# EAGLE board ENERGIS_Main-Board-1.1.0 (EAGLE 9.2.1), part 1 of 3
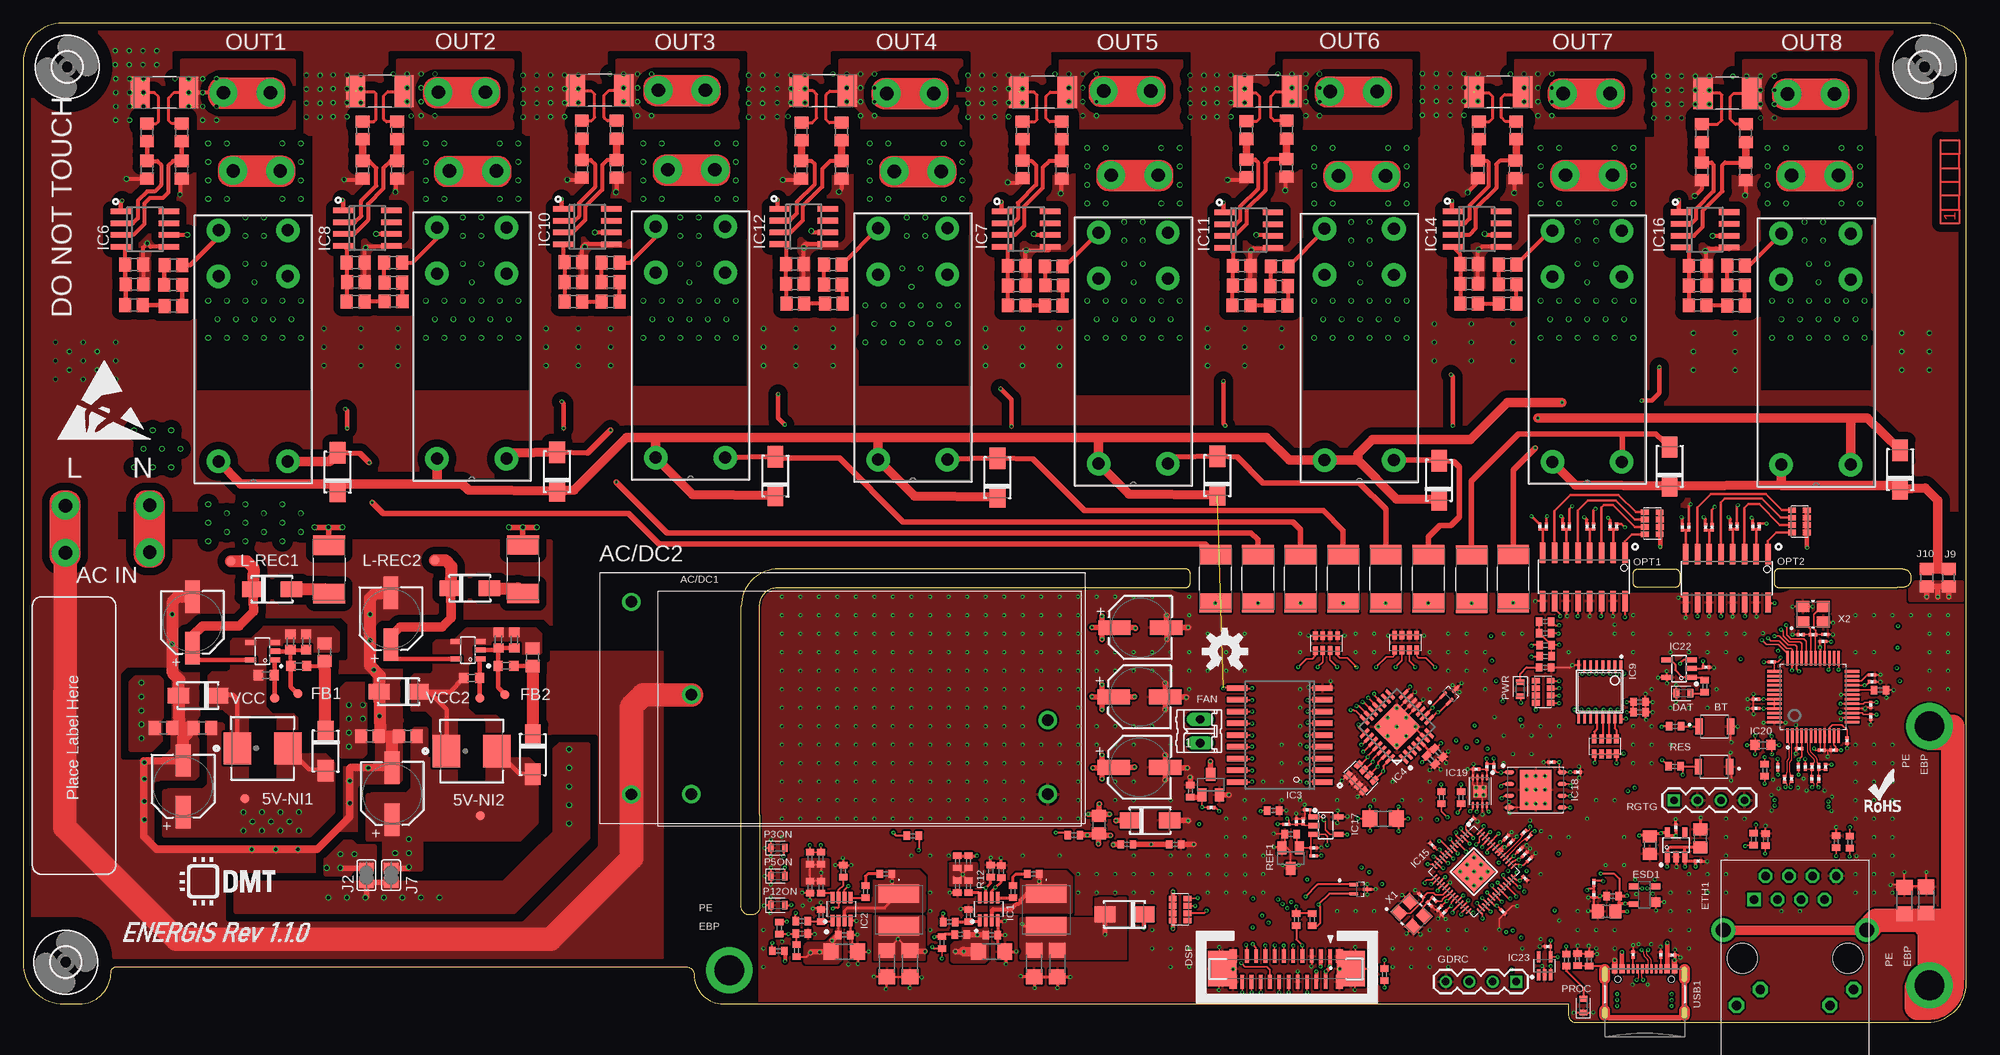
[diagram p10: board, top side]
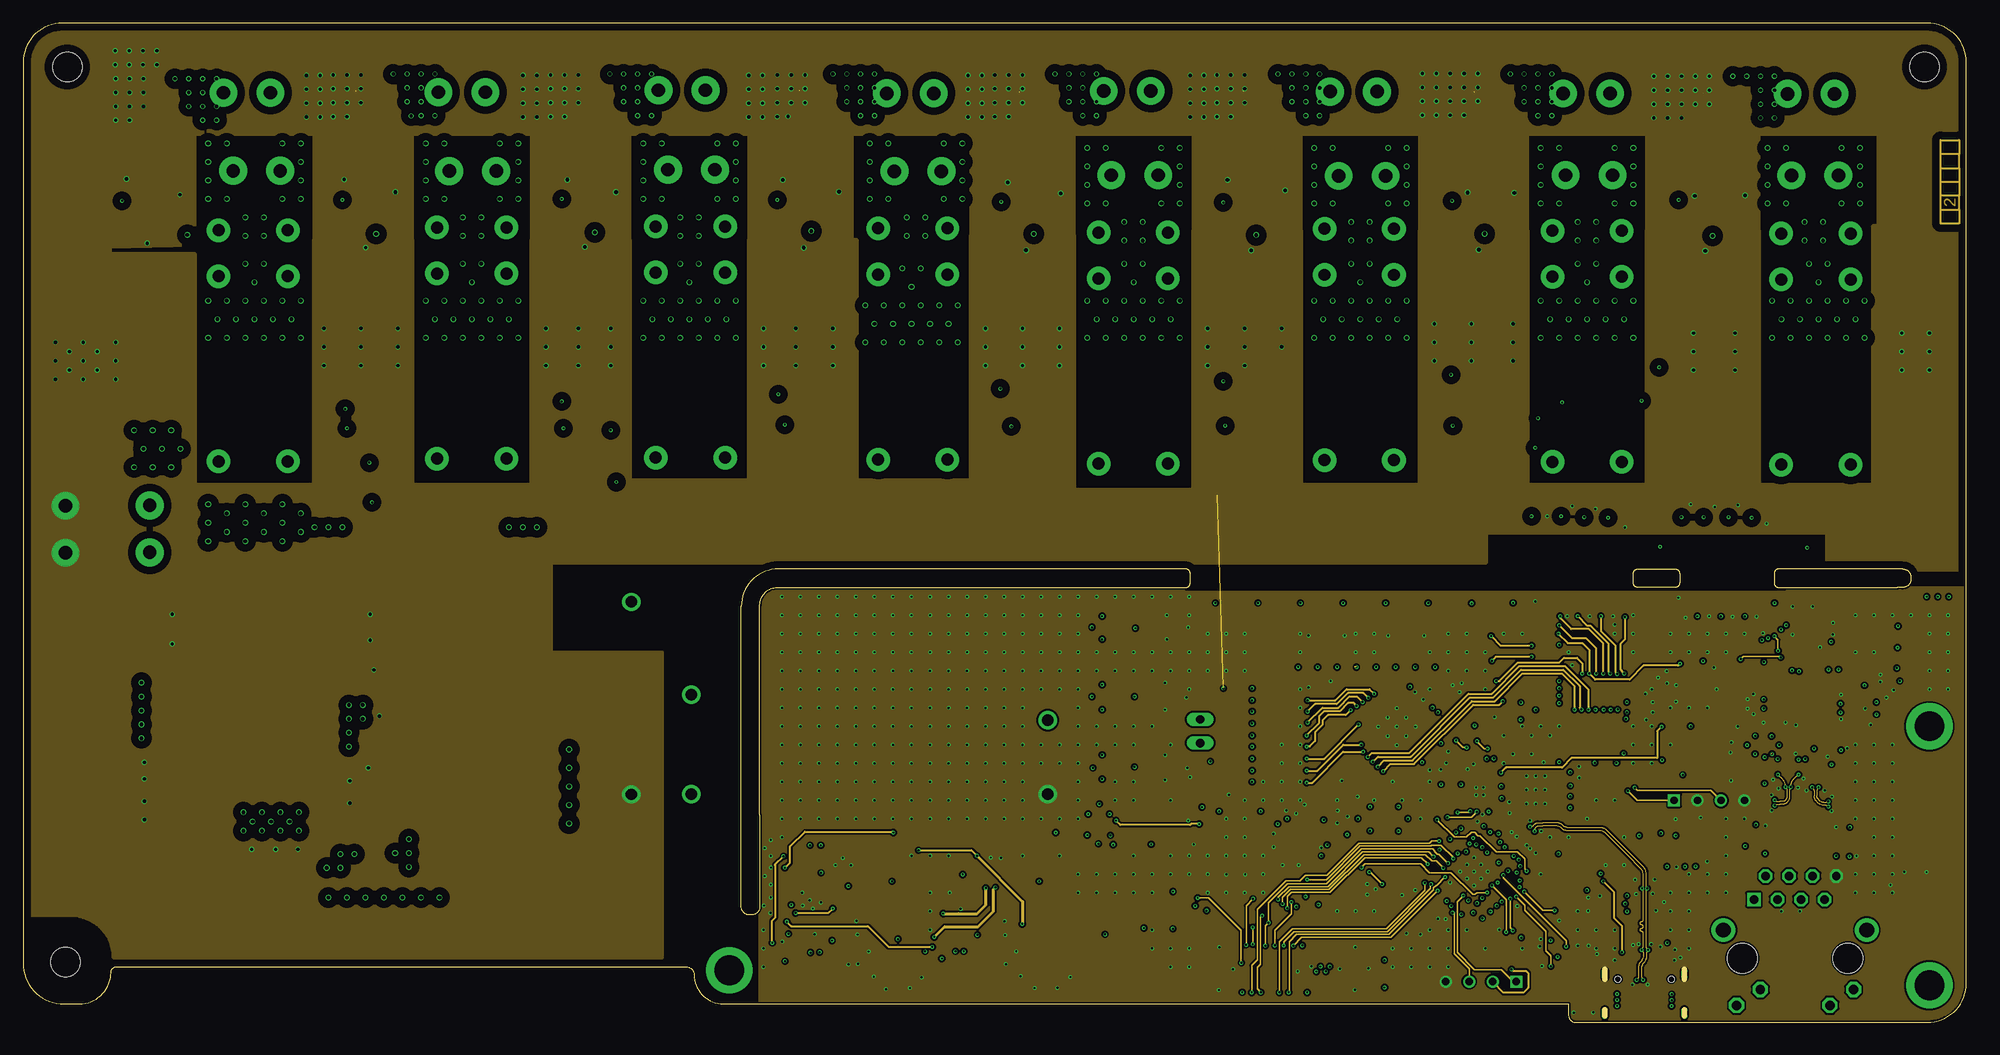
[diagram p11: board, inner layer L2-SIG-HS/AGND]
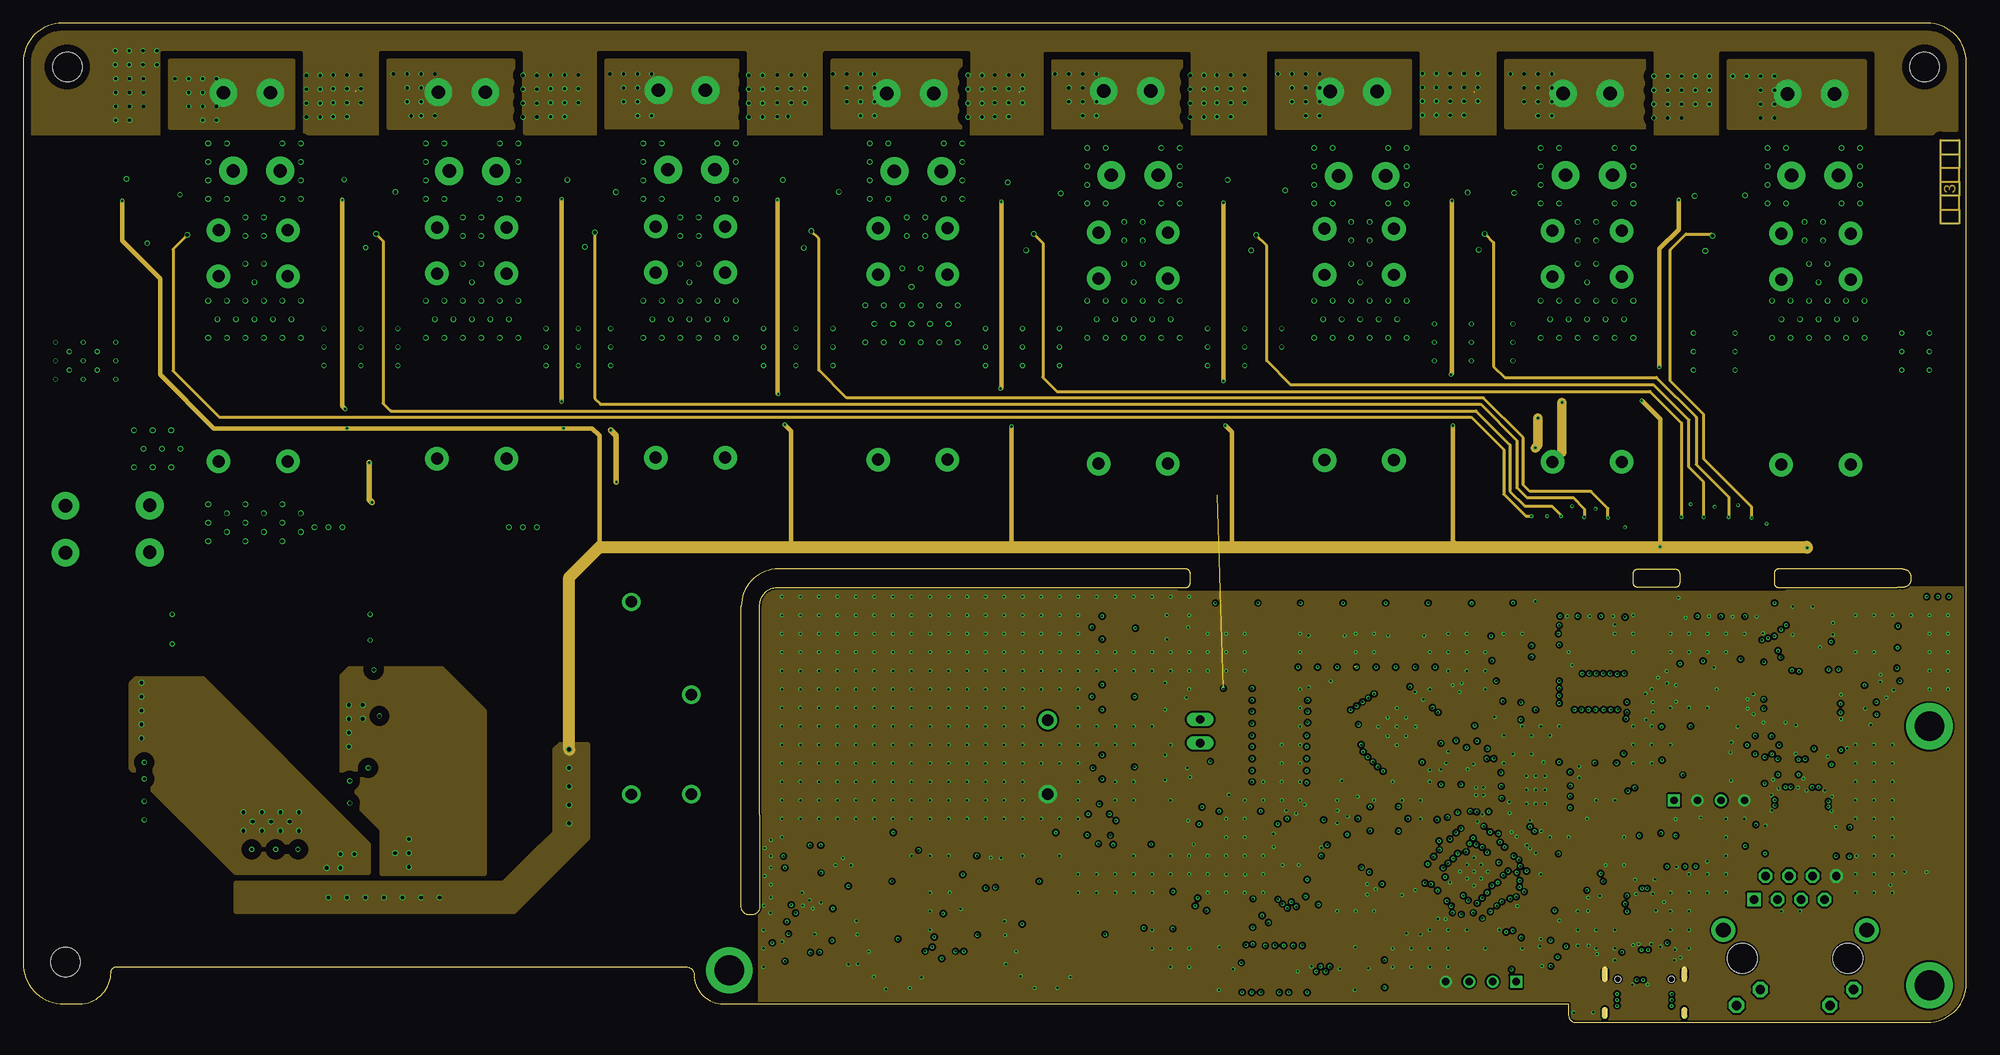
[diagram p12: board, inner layer L3-GND/SIG]
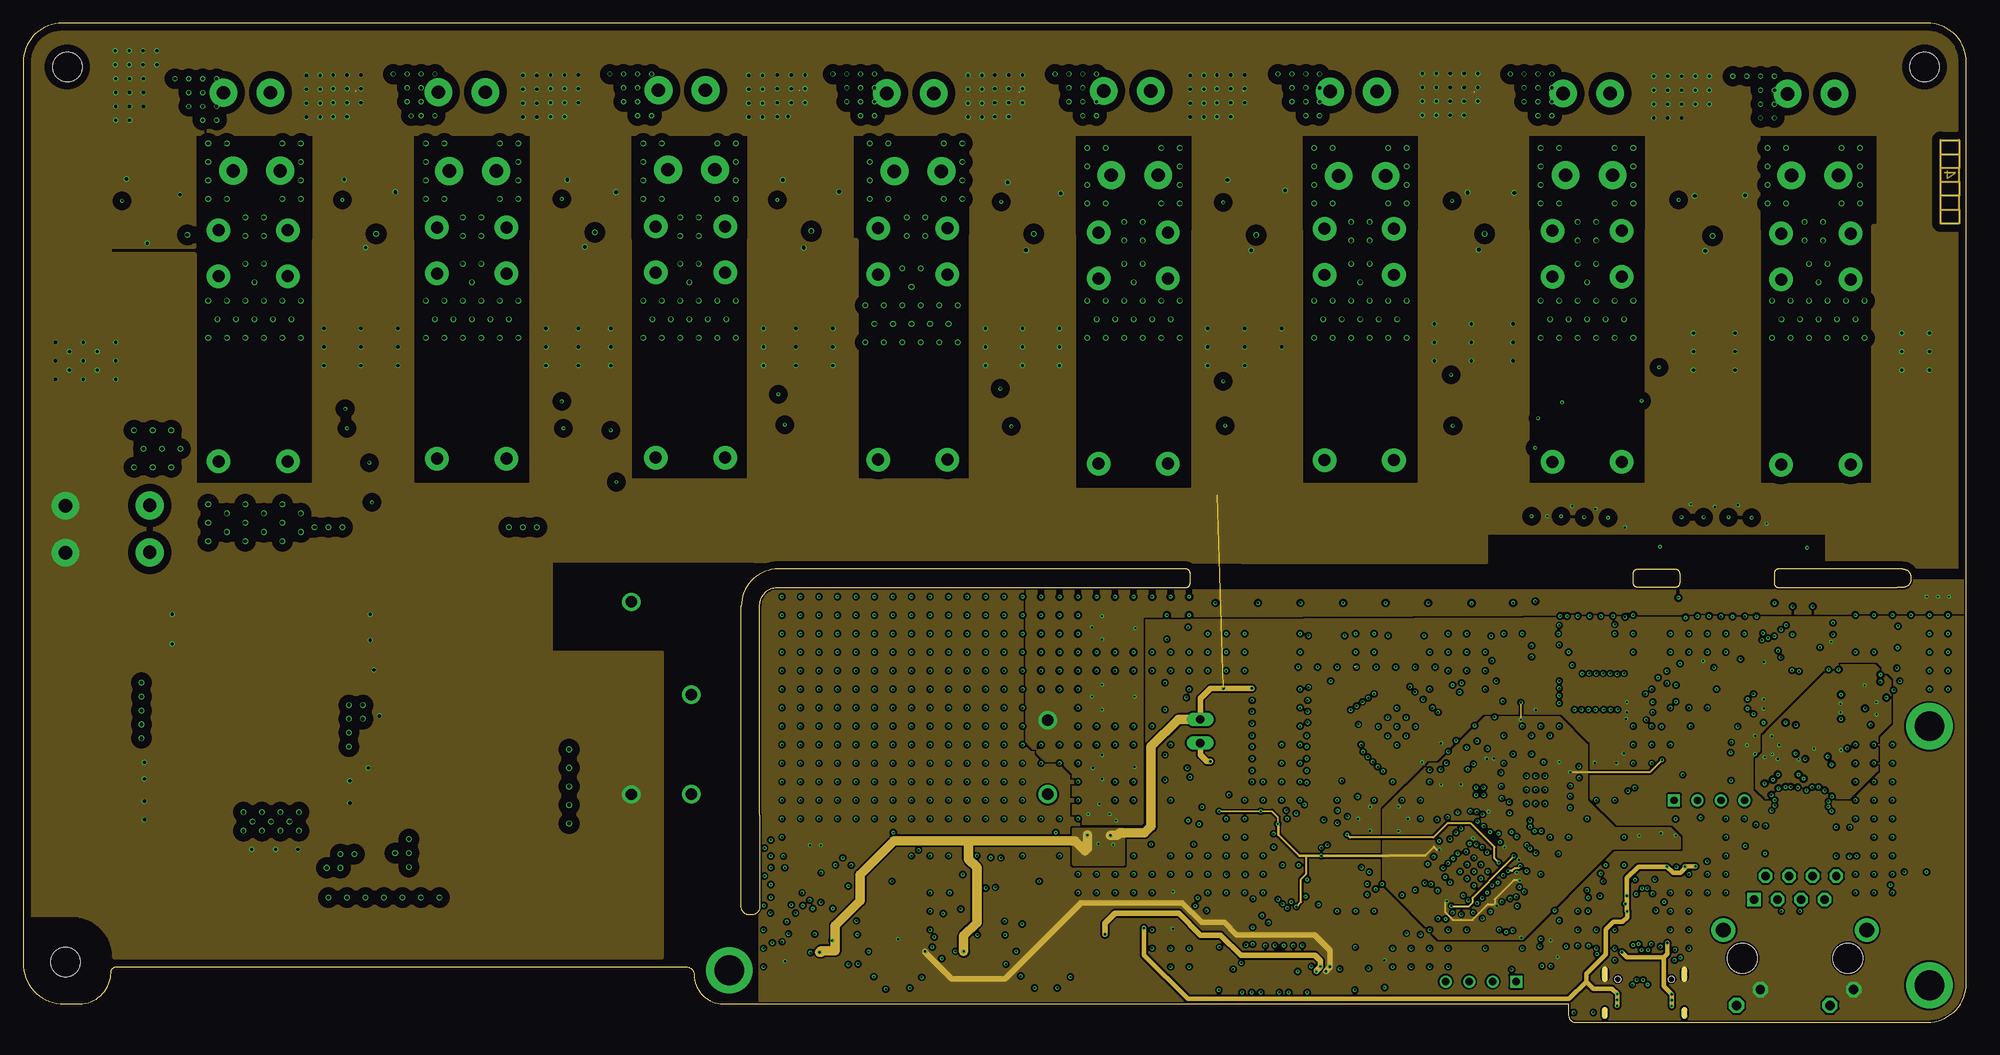
[diagram p13: board, inner layer L4-PWR/AGND]
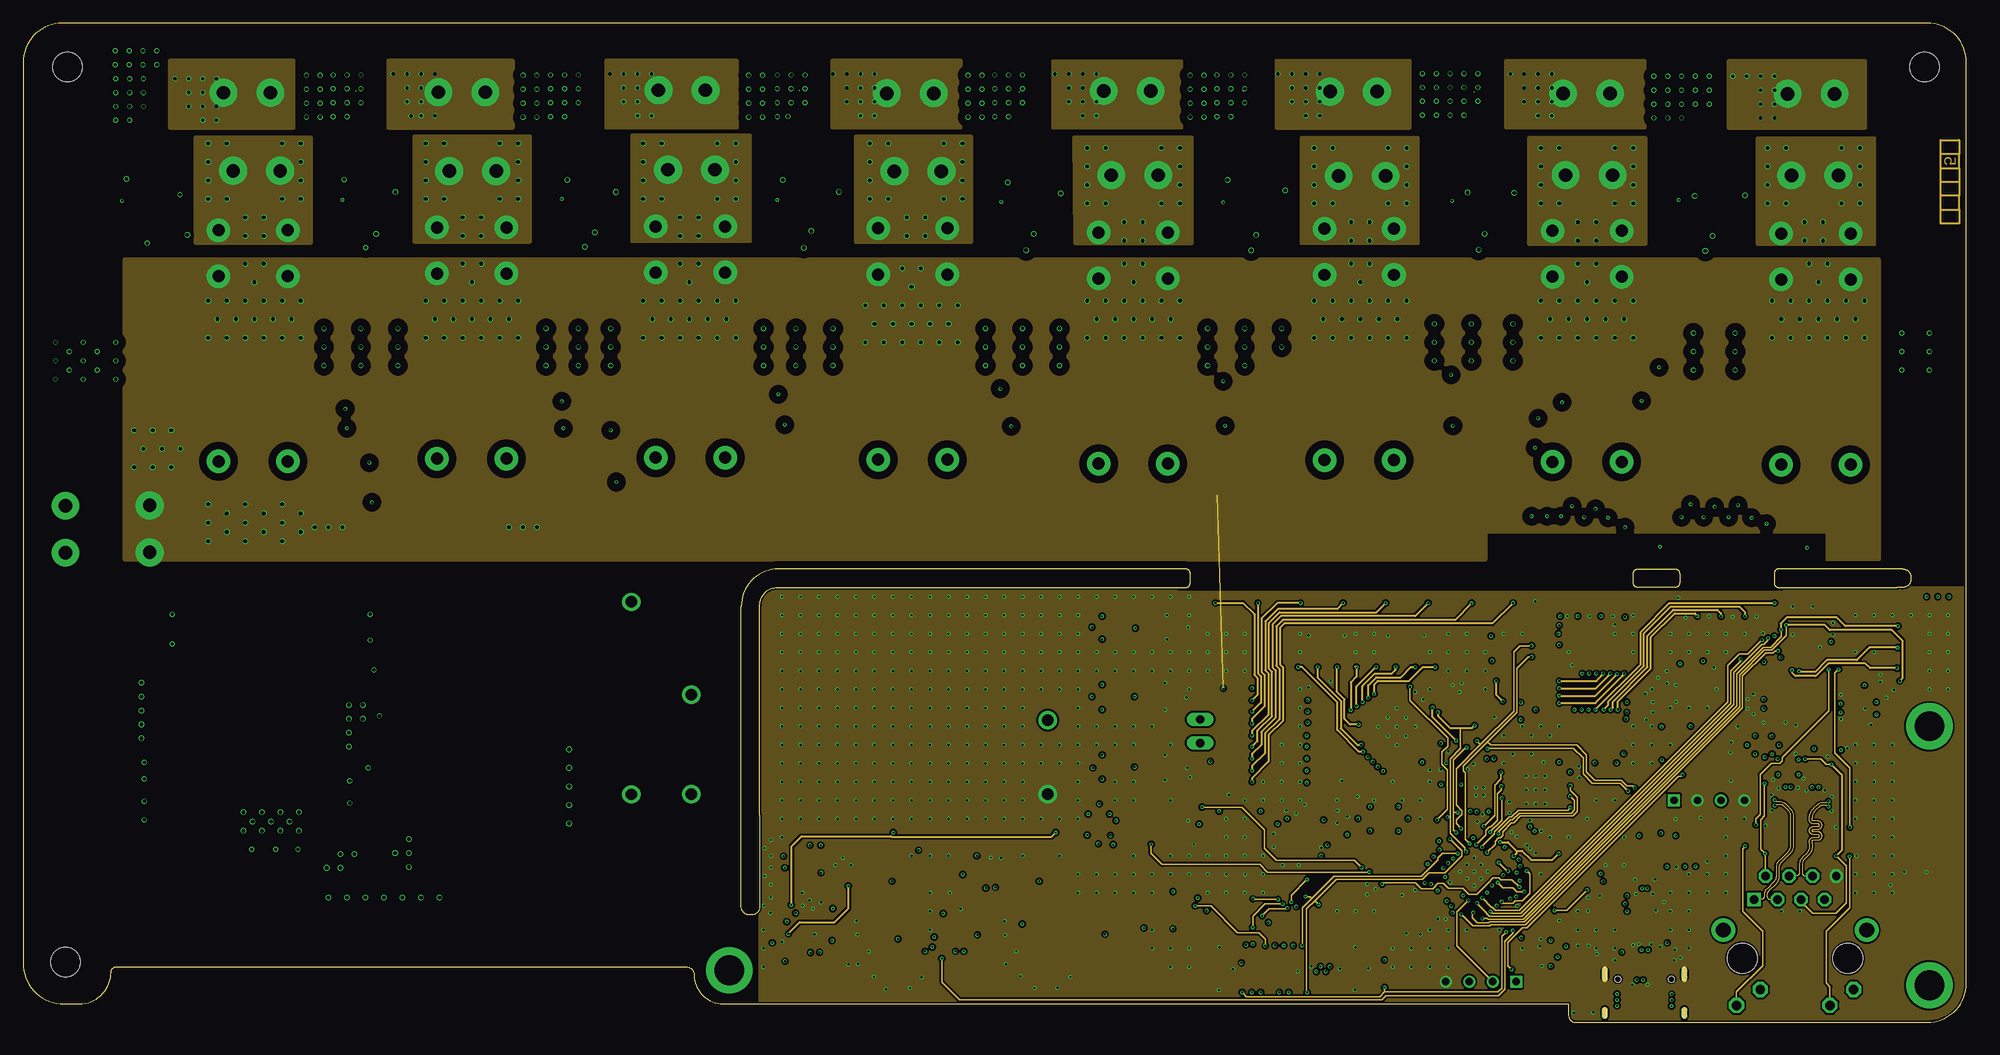
[diagram p14: board, inner layer L5-SIG_LS/AC_L]
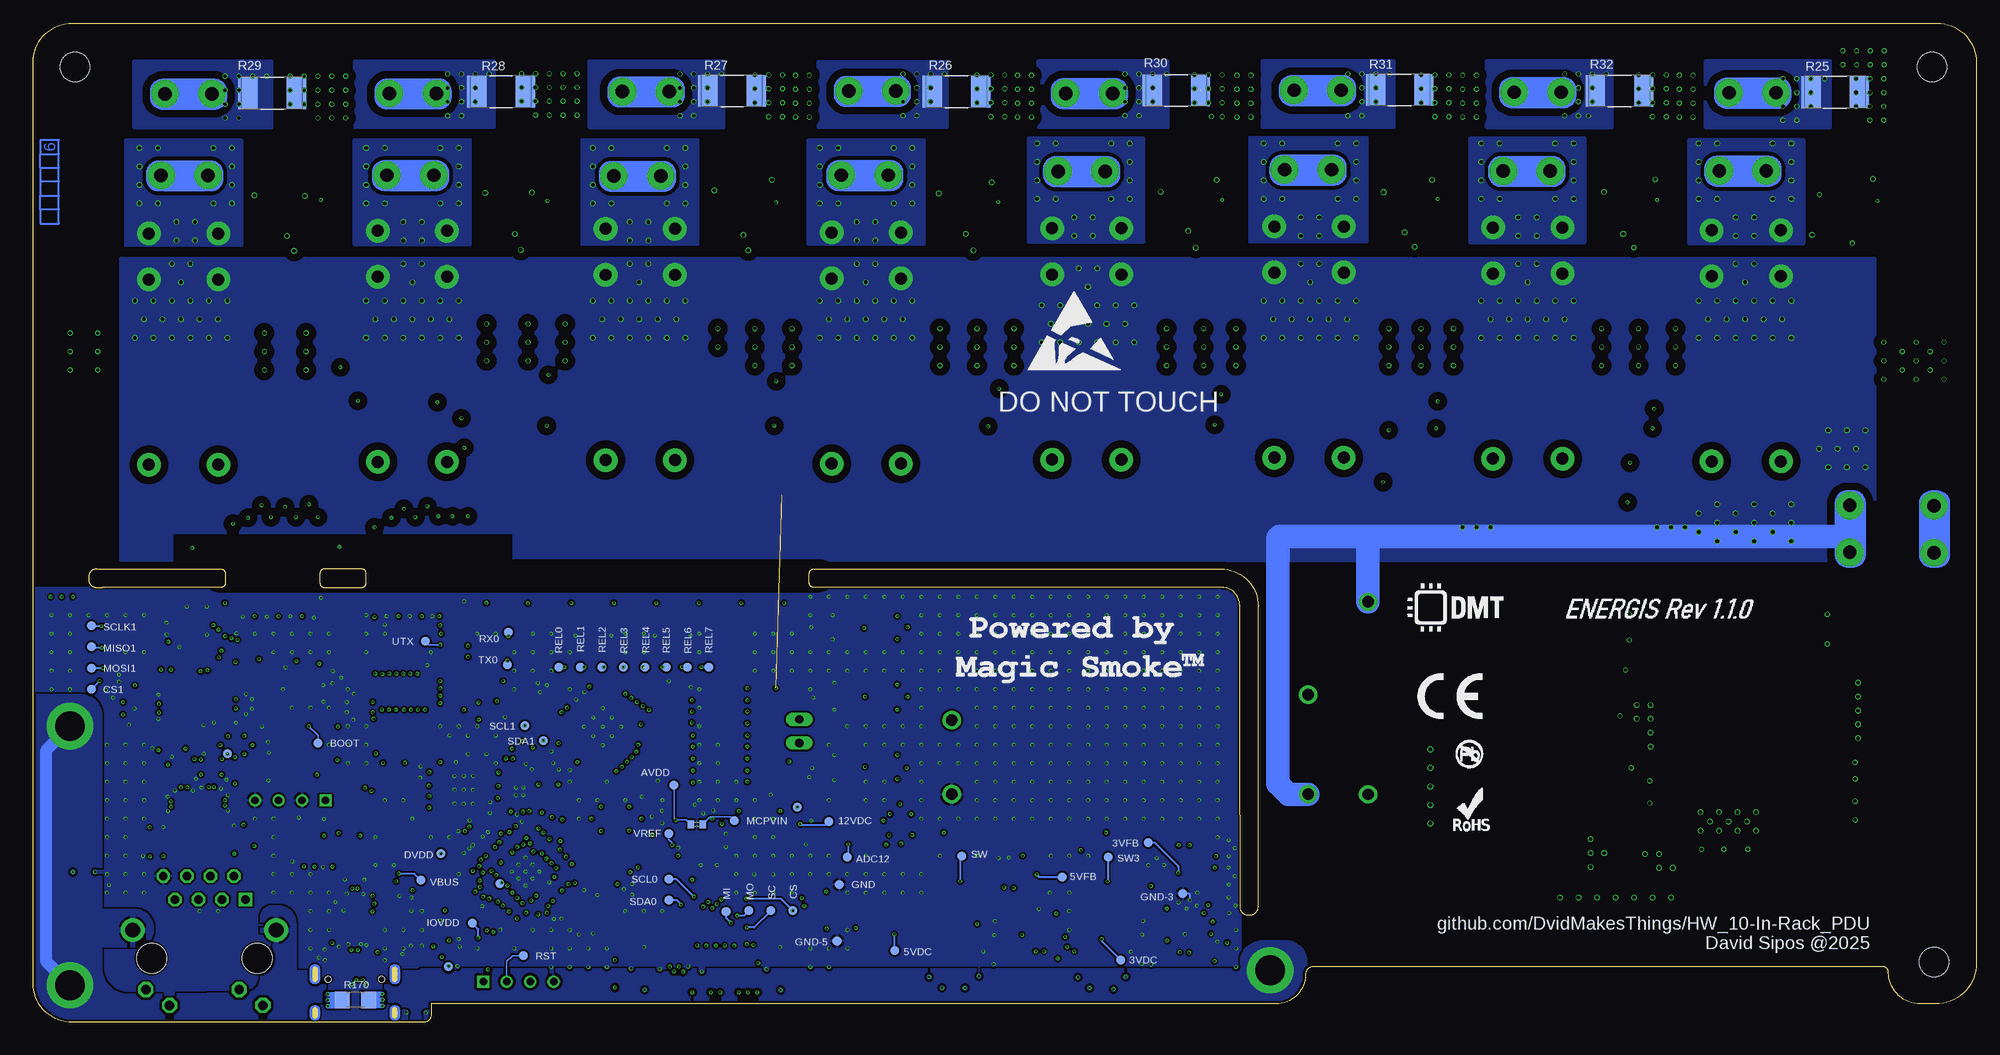
[diagram p15: board, bottom side, seen from below]

Size 210 x 108 mm. Coordinates in mm from the lower left corner, seen from the top.
Outline: 77.6,12.48 77.6,44.97
Outline: 77.6,44.97 arc-90 81.63,49 125.62,49 arc-90 126.12,48.5 126.12,47.5 arc-90 125.62,47 81.51,47 arc90 79.6,45.09 79.6,22.44 79.6,12.5 arc-90 78.7,11.6 78.5,11.6 arc-90 77.6,12.5 77.6,44.97
Outline: 210,4.23 210,103.77 arc90 205.77,108 4.23,108 arc90 0,103.77 0,6.39 arc90 4.39,2 6.08,2 arc90 9.5,5.42 arc-90 10.08,6 71.65,6 arc-90 72.5,5.15 arc90 75.65,2 167,2 167,0.77 arc90 167.77,0 205.77,0 arc90 210,4.23
Outline: 203.11,49 arc-90 204,48.11 204,47.9 arc-90 203.1,47 202.53,47 189.72,47 arc-90 189.22,47.5 189.22,48.5 arc-90 189.72,49 203.11,49
Outline: 174.5,49 178.5,49 arc-90 179,48.5 179,47.5 arc-90 178.5,47 174.5,47 arc-90 174,47.5 174,48.5 arc-90 174.5,49
Copper layers (1+2*3+14*15+16): L1-GND/SIG 0.035mm / dielectric 0.0994mm / L2-SIG-HS/AGND 0.0152mm / dielectric 0.55mm / L3-GND/SIG 0.0152mm / dielectric 0.1088mm / L4-PWR/AGND 0.0152mm / dielectric 0.55mm / L5-SIG_LS/AC_L 0.0152mm / dielectric 0.0994mm / L3-GND/AC_L 0.035mm
Design rules "JLC06161H-3313_6-layer_50RSE-85RD-90RD-100RD": minimum track width 3.5mil, minimum drill 0.15mm, track to track 3.5mil, track to pad 3.5mil, pad to pad 3.5mil, via to via 3.5mil, smd to smd 3.5mil, copper to edge 0.2mm, drill to drill 6mil, minimum pad ring 3.5mil, minimum via ring 3.5mil, stop-mask expansion 0.05mm, vias tented up to drill 16mil, thermal gap 10mil
Net classes: 0 50R_SE: width 0.148 mm, drill 0.2 mm, clearance 0.163 mm; 1 100R_DIFFPAIR: width 0.102 mm, drill 0.2 mm, clearance 0.191 mm; 2 90R_DIFFPAIR: width 0.131 mm, drill 0.2 mm, clearance 0.191 mm; 3 AC_MEA: width 0.406 mm, drill 0.35 mm, clearance 0.203 mm; 4 AC_SIG: width 0.305 mm, drill 0.2 mm, clearance 0.35 mm
tKeepout: 1 lines
bKeepout: 1 lines
tRestrict: 163 lines
bRestrict: 1 lines
vRestrict: 1 lines

## Footprints (pad centres in the part's own frame; a part is rotated, then mirrored left to right if it is on the bottom)
TP-ROUND = smd 1 x 1: TP 0,0
IRM_10_12 = drill 1.24: +V 19.25,0.02; -V 19.25,-7.98; AC_L -19.25,-7.98; AC_N -19.25,2.77
IRM_15_12 = drill 1.24: +V 23.47,-2.4; -V 23.47,-10.4; AC/L -21.53,10.4; AC/N -21.53,-10.4
1217861-1 = drill 1.45 pad 3: 1 0,0; 2 5.08,0
B3U-1000P = smd 0.8 x 1.7: 1 -1.7,0; 2 1.7,0
1206 = smd 1.6 x 1.803: 1 -1.422,0; 2 1.422,0
0402 = smd 0.7 x 0.9: 1 -0.65,0; 2 0.65,0
0603 = smd 1 x 1.1: 1 -0.85,0; 2 0.85,0
6.3X7.7(DXL) = smd 3.5 x 1.6: 1 2.8,0; 2 -2.8,0
0805 = smd 1.3 x 1.5: 1 -0.95,0; 2 0.95,0
0201 = smd 0.34 x 0.35: 1 -0.275,0; 2 0.275,0
SMA/DO-214AC = smd 2.3 x 1.7: A 2.1,0; C -2.1,0
SC75 = smd 0.99 x 0.3: 1 -0.72,0.5; 2 -0.72,-0.5; 3 0.72,0
LED-0603 = smd 0.612 x 0.912: A 0.75,0; C -0.75,0
FPC20 = smd 0.4 x 1.5: 1 -4.552,-1.362; 2 -4.052,1.438; 3 -3.552,-1.362; 4 -3.052,1.438; 5 -2.552,-1.362; 6 -2.052,1.438; 7 -1.552,-1.362; 8 -1.052,1.438; 9 -0.552,-1.362; 10 -0.052,1.438; 11 0.448,-1.362; 12 0.948,1.438; 13 1.448,-1.362; 14 1.948,1.438; 15 2.448,-1.362; 16 2.948,1.438; 17 3.448,-1.362; 18 3.948,1.438; 19 4.448,-1.362; 20 4.948,1.438 | smd 3.048 x 3.81: Z0 -6.795,0; Z5 7.112,0 | smd 0.8 x 1.5: Z1 -5.552,-1.362; Z2 -5.552,1.438; Z3 5.948,-1.362; Z4 5.948,1.438
SOT143 = smd 1 x 1: 1 -0.75,-1.2 | smd 0.6 x 1: 2 0.95,-1.2; 3 0.95,1.2; 4 -0.95,1.2
J1B1211CCD = drill 0.9 square: 1 -4.445,6.35 | drill 0.9 octagon: 2 -3.175,8.89; 3 -1.905,6.35; 4 -0.635,8.89; 5 0.635,6.35; 6 1.905,8.89; 7 3.175,6.35; 8 4.445,8.89 | drill 1.02 octagon: 9 -6.325,-5.08; 10 -3.758,-3.38; 11 3.758,-5.08; 12 6.325,-3.38 | drill 1.6: 13 -7.75,3.05; 14 7.75,3.05 | hole 3.25: -5.715,0; 5.715,0
02P = drill 0.914 long: 1 -1.27,0; 2 1.27,0
1X4 = drill 0.8 square: 1 0,3.81 | drill 0.8: 2 0,1.27; 3 0,-1.27; 4 0,-3.81
SOT65P280X110-8N = smd 1.259 x 0.4: 1 -1.228,0.975; 2 -1.228,0.325; 3 -1.228,-0.325; 4 -1.228,-0.975; 5 1.228,-0.975; 6 1.228,-0.325; 7 1.228,0.325; 8 1.228,0.975
SO18 = smd 0.6 x 2.2: 1 -5.08,-4.6; 2 -3.81,-4.6; 3 -2.54,-4.6; 4 -1.27,-4.6; 5 0,-4.6; 6 1.27,-4.6; 7 2.54,-4.6; 8 3.81,-4.6; 9 5.08,-4.6; 10 5.08,4.6; 11 3.81,4.6; 12 2.54,4.6; 13 1.27,4.6; 14 0,4.6; 15 -1.27,4.6; 16 -2.54,4.6; 17 -3.81,4.6; 18 -5.08,4.6
QFN28[6X6]ML = smd 1.27 x 0.35: 1 -2.985,1.95; 2 -2.985,1.3; 3 -2.985,0.65; 4 -2.985,0; 5 -2.985,-0.65; 6 -2.985,-1.3; 7 -2.985,-1.95; 15 2.985,-1.95; 16 2.985,-1.3; 17 2.985,-0.65; 18 2.985,0; 19 2.985,0.65; 20 2.985,1.3; 21 2.985,1.95 | smd 0.35 x 1.27: 8 -1.95,-2.985; 9 -1.3,-2.985; 10 -0.65,-2.985; 11 0,-2.985; 12 0.65,-2.985; 13 1.3,-2.985; 14 1.95,-2.985; 22 1.95,2.985; 23 1.3,2.985; 24 0.65,2.985; 25 0,2.985; 26 -0.65,2.985; 27 -1.3,2.985; 28 -1.95,2.985 | smd 3.7 x 3.7: PAD 0,0
SOT23-5 = smd 0.55 x 1.2: 1 -0.95,-1.3; 2 0,-1.3; 3 0.95,-1.3; 4 0.95,1.3; 5 -0.95,1.3
SO8 = smd 0.6 x 2.2: 1 -1.905,-2.6; 2 -0.635,-2.6; 3 0.635,-2.6; 4 1.905,-2.6; 5 1.905,2.6; 6 0.635,2.6; 7 -0.635,2.6; 8 -1.905,2.6
TSSOP16 = smd 0.305 x 0.991: 1 -2.275,-2.918; 2 -1.625,-2.918; 3 -0.975,-2.918; 4 -0.325,-2.918; 5 0.325,-2.918; 6 0.975,-2.918; 7 1.625,-2.918; 8 2.275,-2.918; 9 2.275,2.918; 10 1.625,2.918; 11 0.975,2.918; 12 0.325,2.918; 13 -0.325,2.918; 14 -0.975,2.918; 15 -1.625,2.918; 16 -2.275,2.918
QFN56 = smd 0.837 x 0.22: 1 -3.437,2.6; 2 -3.437,2.2; 3 -3.437,1.8; 4 -3.437,1.4; 5 -3.437,1; 6 -3.437,0.6; 7 -3.437,0.2; 8 -3.437,-0.2; 9 -3.437,-0.6; 10 -3.437,-1; 11 -3.437,-1.4; 12 -3.437,-1.8; 13 -3.437,-2.2; 14 -3.437,-2.6; 29 3.437,-2.6; 30 3.437,-2.2; 31 3.437,-1.8; 32 3.437,-1.4; 33 3.437,-1; 34 3.437,-0.6; 35 3.437,-0.2; 36 3.437,0.2; 37 3.437,0.6; 38 3.437,1; 39 3.437,1.4; 40 3.437,1.8; 41 3.437,2.2; 42 3.437,2.6 | smd 0.22 x 0.837: 15 -2.6,-3.437; 16 -2.2,-3.437; 17 -1.8,-3.437; 18 -1.4,-3.437; 19 -1,-3.437; 20 -0.6,-3.437; 21 -0.2,-3.437; 22 0.2,-3.437; 23 0.6,-3.437; 24 1,-3.437; 25 1.4,-3.437; 26 1.8,-3.437; 27 2.2,-3.437; 28 2.6,-3.437; 43 2.6,3.437; 44 2.2,3.437; 45 1.8,3.437; 46 1.4,3.437; 47 1,3.437; 48 0.6,3.437; 49 0.2,3.437; 50 -0.2,3.437; 51 -0.6,3.437; 52 -1,3.437; 53 -1.4,3.437; 54 -1.8,3.437; 55 -2.2,3.437; 56 -2.6,3.437 | smd 3.2 x 3.2: PAD 0,0
SON127P600X500X75-8N = smd 1.012 x 0.432: 1 -2.85,1.905; 2 -2.85,0.635; 3 -2.85,-0.635; 4 -2.85,-1.905; 5 2.85,-1.905; 6 2.85,-0.635; 7 2.85,0.635; 8 2.85,1.905 | smd 3.4 x 4.3: PAD 0,0
SON50P300X200X50-9T130X140N = smd 0.711 x 0.27: 1 -1.501,0.75; 2 -1.501,0.25; 3 -1.501,-0.25; 4 -1.501,-0.75; 5 1.501,-0.75; 6 1.501,-0.25; 7 1.501,0.25; 8 1.501,0.75 | smd 1.3 x 1.4: 9 0,0
LQFP48 = smd 1.56 x 0.28: 1 -4.18,2.75; 2 -4.18,2.25; 3 -4.18,1.75; 4 -4.18,1.25; 5 -4.18,0.75; 6 -4.18,0.25; 7 -4.18,-0.25; 8 -4.18,-0.75; 9 -4.18,-1.25; 10 -4.18,-1.75; 11 -4.18,-2.25; 12 -4.18,-2.75; 25 4.18,-2.75; 26 4.18,-2.25; 27 4.18,-1.75; 28 4.18,-1.25; 29 4.18,-0.75; 30 4.18,-0.25; 31 4.18,0.25; 32 4.18,0.75; 33 4.18,1.25; 34 4.18,1.75; 35 4.18,2.25; 36 4.18,2.75 | smd 0.28 x 1.56: 13 -2.75,-4.18; 14 -2.25,-4.18; 15 -1.75,-4.18; 16 -1.25,-4.18; 17 -0.75,-4.18; 18 -0.25,-4.18; 19 0.25,-4.18; 20 0.75,-4.18; 21 1.25,-4.18; 22 1.75,-4.18; 23 2.25,-4.18; 24 2.75,-4.18; 37 2.75,4.18; 38 2.25,4.18; 39 1.75,4.18; 40 1.25,4.18; 41 0.75,4.18; 42 0.25,4.18; 43 -0.25,4.18; 44 -0.75,4.18; 45 -1.25,4.18; 46 -1.75,4.18; 47 -2.25,4.18; 48 -2.75,4.18
SC70-5 = smd 1.186 x 0.397: 1 -0.962,0.65; 2 -0.962,0; 3 -0.962,-0.65; 4 0.962,-0.65; 5 0.962,0.65
SJ = smd 1.168 x 1.6: 1 -0.762,0; 2 0.762,0
RELAY_G2RL-1A-E_DC5_OMR = drill 1.295 pad 2.54: 1 -3.683,12.776; 3 -3.683,-7.239; 4 -3.683,-12.217; 5 3.81,-12.217; 6 3.81,-7.239; 8 3.81,12.776
SRR5228A = smd 4.4 x 2: 1 0,1.75; 2 0,-1.75
L-6.6X6.6 = smd 2.95 x 3.5: 1 -2.725,0; 2 2.725,0
SO16 = smd 0.61 x 2.21: 1 -4.445,-2.616; 2 -3.175,-2.616; 3 -1.905,-2.616; 4 -0.635,-2.616; 5 0.635,-2.616; 6 1.905,-2.616; 7 3.175,-2.616; 8 4.445,-2.616; 9 4.445,2.616; 10 3.175,2.616; 11 1.905,2.616; 12 0.635,2.616; 13 -0.635,2.616; 14 -1.905,2.616; 15 -3.175,2.616; 16 -4.445,2.616
2512 = smd 2.08 x 3.44: 1 -2.616,0; 2 2.616,0
_0603X4-1206 = smd 0.59 x 0.92: A1 -1.2,-0.8; A2 -1.2,0.8; B1 -0.4,-0.8; B2 -0.4,0.8; C1 0.4,-0.8; C2 0.4,0.8; D1 1.2,-0.8; D2 1.2,0.8
R0201 = smd 0.34 x 0.35: 1 -0.275,0; 2 0.275,0
SOT23 = smd 1 x 1.4: 1 -0.95,-1.1; 2 0.95,-1.1; 3 0,1.1
3,2 = hole 3.2: 0,0
USB-C = smd 0.3 x 1: A5 -1.18,3.37; A6 -0.18,3.37; A7 0.32,3.37; A8 1.32,3.37; B5 1.82,3.37; B6 0.82,3.37; B7 -0.68,3.37; B8 -1.68,3.37 | smd 0.6 x 1: GND -3.155,3.37; GND2 3.295,3.37; VBUS1 -2.38,3.37; VBUS2 2.52,3.37 | drill 0.4 pad 0.6 long: SHLD1 -4.248,2.795; SHLD2 4.388,2.795; SHLD3 -4.248,-1.385; SHLD4 4.388,-1.385 | hole 0.65: -2.82,2.265; 2.96,2.265
WE-XTAL_CFPX-180 = smd 1.4 x 1.2: 1 -1.1,-0.85; 2 1.1,-0.85; 3 1.1,0.85; 4 -1.1,0.85

## Placement (x,y rotation side)
3V3A  DNI  [TP-ROUND]  188.98,29.06 0 bottom
3VDC  DNI  [TP-ROUND]  92.48,6.74 90 bottom
3VFB  DNI  [TP-ROUND]  89.51,19.44 90 bottom
5V-NI1  DNI  [TP-ROUND]  23.99,24.18 0 top
5V-NI2  DNI  [TP-ROUND]  49.43,22.32 180 top
5VDC  DNI  [TP-ROUND]  116.88,7.78 180 bottom
5VFB  DNI  [TP-ROUND]  98.79,15.68 270 bottom
12VDC  DNI  [TP-ROUND]  124,21.71 0 bottom
AC/DC1  IRM_10_12  [IRM_10_12]  91.47,32.64 0 top
AC/DC2  IRM-15-12  [IRM_15_12]  87.27,35.04 0 top
AC_L  FASTON-1217861-1  [1217861-1]  13.68,50.79 90 top
AC_N  FASTON-1217861-1  [1217861-1]  4.57,50.76 90 top
ADC12  DNI  [TP-ROUND]  121.99,17.88 180 bottom
ADC_TEMP  DNI  [TP-ROUND]  165.14,6.01 0 bottom
ADCUSB  DNI  [TP-ROUND]  159.57,14.99 0 bottom
AVDD  DNI  [TP-ROUND]  140.73,25.62 180 bottom
BOOT  DNI  [TP-ROUND]  179.2,30.2 0 bottom
BT  B3U-1000P  [B3U-1000P]  182.79,31.99 0 top
C1  22uF 25V  [1206]  104.66,7.65 0 top
C2  22uF 25V  [1206]  88.73,7.64 0 top
C3  100nF 25V  [0402]  104.66,9.45 0 top
C4  100nF 25V  [0402]  88.73,9.44 0 top
C5  1nF 50V  [0603]  28.88,41.11 270 top
C6  100nF 25V  [0402]  104.56,16.35 90 top
C7  100nF 25V  [0402]  88.63,16.34 90 top
C8  100nF 25V  [0402]  109.16,16.05 0 top
C9  100nF 25V  [0402]  93.23,16.04 0 top
C10  100uF 25V  [6.3X7.7(DXL)]  120.73,42.66 180 top
C11  33pF 50V  [0402]  100.96,17.35 270 top
C12  33pF 50V  [0402]  85.03,17.74 270 top
C13  100uF 25V  [6.3X7.7(DXL)]  120.63,35.16 180 top
C14  22uF 25V  [1206]  111.76,6.35 270 top
C15  22uF 25V  [1206]  95.83,6.34 270 top
C16  100uF 25V  [6.3X7.7(DXL)]  120.63,27.56 180 top
C17  22uF 25V  [1206]  109.26,6.35 270 top
C18  22uF 25V  [1206]  93.33,6.34 270 top
C19  100nF 25V  [0402]  152.13,28.36 315 top
C20  100nF 25V  [0402]  152.95,29.14 315 top
C21  2.2uF 50V  [0603]  26.28,37.51 0 top
C22  220nF 50V  [0805]  32.58,40.01 270 top
C23  100uF 50V  [6.3X7.7(DXL)]  17.28,25.51 270 top
C24  33nF 50V  [0805]  13.38,92.16 270 top
C25  33nF 50V  [0805]  17.13,92.16 270 top
C26  33nF 50V  [0805]  12,81.9 0 top
C27  33nF 50V  [0805]  107.98,92.18 270 top
C28  33nF 50V  [0805]  112.23,92.16 270 top
C29  33nF 50V  [0805]  107.37,81.76 0 top
C30  33nF 50V  [0805]  36.68,92.16 270 top
C31  33nF 50V  [0805]  40.43,92.16 270 top
C32  33nF 50V  [0805]  35.95,79.99 0 top
C33  100nF 25V  [0402]  174.67,33.53 0 top
C34  100nF 25V  [0402]  174.67,34.63 0 top
C35  2.2uF 400V  [6.3X7.7(DXL)]  18.29,43.22 270 top
C36  33nF 50V  [0805]  60.38,92.26 270 top
C37  33nF 50V  [0805]  64.13,92.26 270 top
C38  33nF 50V  [0805]  59.47,82.16 0 top
C39  33nF 50V  [0805]  132.2,92.31 270 top
C40  33nF 50V  [0805]  136.53,92.36 270 top
C41  33nF 50V  [0805]  131.67,81.76 0 top
C42  33nF 50V  [0805]  84.08,92.16 270 top
C43  33nF 50V  [0805]  88.43,92.16 270 top
C44  33nF 50V  [0805]  83.37,81.96 0 top
C45  1uF 50V  [0805]  19.38,31.81 0 top
C46  2.2uF 50V  [0603]  48.48,37.23 0 top
C47  2.2uF 400V  [6.3X7.7(DXL)]  39.74,43.62 270 top
C48  33nF 50V  [0805]  157.2,92.17 270 top
C49  33nF 50V  [0805]  161.23,92.17 270 top
C50  33nF 50V  [0805]  156.25,81.96 0 top
C51  1nF 50V  [0603]  51.38,41.33 270 top
C52  220nF 50V  [0805]  55.05,39.44 270 top
C53  100uF 50V  [6.3X7.7(DXL)]  39.88,24.73 270 top
C54  33nF 50V  [0805]  181.39,91.97 270 top
C55  33nF 50V  [0805]  186.13,91.97 270 top
C56  33nF 50V  [0805]  180.95,81.76 0 top
C57  1uF 50V  [0805]  41.58,30.93 0 top
C58  15pF 50V  [0201]  151.07,13.68 135 top
C59  15pF 50V  [0201]  151.97,12.78 315 top
C60  1uF 25V  [0402]  136.99,20.35 180 top
C61  100nF 25V  [0201]  139.46,18.87 0 top
C62  100nF 25V  [0201]  138.76,22.96 180 top
C63  100nF 25V  [0201]  138.31,21.72 90 top
C64  100nF 25V  [0201]  165.13,28.12 180 top
C65  10uF 50V  [0805]  171.11,12 180 top
C66  100nF 25V  [0402]  171.78,13.65 180 top
C67  100nF 25V  [0201]  168,27.05 0 top
C68  100nF 25V  [0201]  159.92,11.96 315 top
C69  100nF 25V  [0201]  162.31,15.57 315 top
C70  100nF 25V  [0201]  162.25,18.14 45 top
C71  100nF 25V  [0201]  160.75,19.43 45 top
C72  100nF 25V  [0201]  152.26,19.16 135 top
C73  100nF 25V  [0201]  156.53,21.86 45 top
C74  100nF 25V  [0201]  162.78,17.63 45 top
C75  100nF 25V  [0201]  161.74,18.66 45 top
C76  100nF 25V  [0201]  153.53,11.85 225 top
C77  100nF 25V  [0201]  160.27,19.97 45 top
C78  4.7nF 50V  [0402]  167.97,6.77 90 top
C79  100nF 25V  [0402]  195.92,19.53 90 top
C80  22nF 50V  [0402]  188.29,19.77 90 top
C81  6.8nF 50V  [0201]  193.3,26.31 270 top
C82  6.8nF 50V  [0201]  194.04,26.32 270 top
C83  1nF 2kV  [1206]  205.65,13.24 270 top
C84  100nF 25V  [0201]  199.8,37.55 0 top
C85  4.7uF 25V  [0402]  200.68,35.92 0 top
C86  18pF 50V  [0201]  192.11,41.91 180 top
C87  18pF 50V  [0201]  194.75,41.91 0 top
C88  100nF 25V  [0201]  194.5,41.17 180 top
C89  100nF 25V  [0201]  187.26,33.92 180 top
C90  100nF 25V  [0201]  187.26,34.92 180 top
C91  100nF 25V  [0201]  195.63,29.42 180 top
C92  100nF 25V  [0201]  199.66,33.01 270 top
C93  100nF 25V  [0201]  194.37,29.42 0 top
C94  100nF 25V  [0201]  199.66,34.31 270 top
C95  100nF 25V  [0201]  199.81,36.81 0 top
C96  100nF 25V  [0201]  191.94,29.59 180 top
C97  10uF 50V  [0805]  181.23,19.89 90 top
C98  100nF 25V  [0201]  181,17.42 0 top
C99  10uF 50V  [0805]  175.81,19.14 270 top
C100  100nF 25V  [0201]  178.59,21.07 90 top
C101  100nF 25V  [0201]  153.03,12.35 225 top
C102  1uF 16V  [0201]  137.6,21.7 90 top
C103  100nF 25V  [0201]  181.87,38.39 0 top
C104  1uF 25V  [0402]  135.1,22.9 0 top
C105  100nF 25V  [0201]  164.77,8.2 180 top
C106  1nF 25V  [0201]  172.2,53.6 90 top
C107  1nF 25V  [0201]  169.7,53.6 90 top
C108  1nF 25V  [0201]  167.1,53.6 90 top
C109  1nF 25V  [0201]  164.6,53.6 90 top
C110  1nF 25V  [0201]  187.6,53.6 90 top
C111  1nF 25V  [0201]  185.2,53.6 90 top
C112  1nF 25V  [0201]  182.5,53.5 90 top
C113  1nF 25V  [0201]  180,53.5 90 top
CS  DNI  [TP-ROUND]  127.89,12.07 90 bottom
CS1  DNI  [TP-ROUND]  203.71,36 0 bottom
D1  MBRA340T3G  [SMA/DO-214AC]  33.98,59.47 90 top
D2  MBRA340T3G  [SMA/DO-214AC]  57.69,59.52 90 top
D3  MBRA340T3G  [SMA/DO-214AC]  81.29,59.04 90 top
D4  MBRA340T3G  [SMA/DO-214AC]  105.28,58.87 90 top
D5  MBRA340T3G  [SMA/DO-214AC]  129.06,59.09 90 top
D6  MBRA340T3G  [SMA/DO-214AC]  153,58.59 90 top
D7  MBRA340T3G  [SMA/DO-214AC]  177.93,60.08 90 top
D8  MBRA340T3G  [SMA/DO-214AC]  202.83,59.74 90 top
D9  1N4007  [SMA/DO-214AC]  32.68,29.31 270 top
D10  1N4007  [SMA/DO-214AC]  26.9,46.8 0 top
D11  US1J-E3/61T  [SMA/DO-214AC]  18.88,35.31 180 top
D12  1N4007  [SMA/DO-214AC]  48.28,46.91 0 top
D13  1N4007  [SMA/DO-214AC]  55.08,28.93 270 top
D14  US1J-E3/61T  [SMA/DO-214AC]  40.58,35.73 180 top
D15  DNI  [SMA/DO-214AC]  119.01,11.67 180 top
D16  SMAJ15A  [SMA/DO-214AC]  121.79,21.82 0 top
D17  RCLAMP0582BQTCT  [SC75]  144.51,14.39 0 top
D18  RCLAMP0582BQTCT  [SC75]  154.29,35.5 45 top
DAT  Blue  [LED-0603]  179.4,35.57 0 top
DNI  0R 1%  [0402]  138.29,21.4 0 bottom
DSP  AFC11-S20ICC-00  [FPC20]  136.69,5.8 180 top
DVDD  DNI  [TP-ROUND]  165.9,18.21 0 bottom
ESD1  SP0503BAHTG  [SOT143]  175.22,13.75 90 top
ETH1  J1B1211CCD  [J1B1211CCD]  191.48,6.92 0 top
FAN  DNI  [02P]  127.22,31.47 90 top
FB1  DNI  [TP-ROUND]  29.68,35.51 0 top
FB2  DNI  [TP-ROUND]  52.08,35.43 0 top
FCTL  DNI  [TP-ROUND]  127.41,23.26 0 bottom
GDRC  DNI  [1X4]  157.54,4.39 270 top
GND  DNI  [TP-ROUND]  122.85,14.91 180 bottom
GND-3  DNI  [TP-ROUND]  85.74,13.93 0 bottom
GND-5  DNI  [TP-ROUND]  123.12,8.79 0 bottom
IC1  DNI  [SOT65P280X110-8N]  104.36,12.25 90 top
IC2  MP2315GJ-Z  [SOT65P280X110-8N]  88.43,12.24 90 top
IC3  ULN2803AFWG  [SO18]  135.81,31.05 90 top
IC4  MCP23017T-E/ML  [QFN28[6X6]ML]  148.45,31.95 135 top
IC5  MP150GJ  [SOT23-5]  48.08,40.23 90 top
IC6  HLW8032  [SO8]  13.16,85.72 270 top
IC7  HLW8032  [SO8]  108.4,85.73 270 top
IC8  HLW8032  [SO8]  37.2,85.84 270 top
IC9  SN74HC151PWR  [TSSOP16]  170.37,35.73 180 top
IC10  HLW8032  [SO8]  60.97,85.99 270 top
IC11  HLW8032  [SO8]  132.45,85.62 270 top
IC12  HLW8032  [SO8]  84.34,86.01 270 top
IC13  MP150GJ  [SOT23-5]  25.88,40.11 90 top
IC14  HLW8032  [SO8]  157.11,85.74 270 top
IC15  RP2040  [QFN56]  156.78,16.29 315 top
IC16  HLW8032  [SO8]  181.74,85.66 270 top
IC17  MCP6001RT-I/OT  [SOT23-5]  140.77,21.26 270 top
IC18  W25Q128JVPIQ  [SON127P600X500X75-8N]  163.45,25.13 0 top
IC19  CAT24C256HU4IGT3  [SON50P300X200X50-9T130X140N]  157.42,24.98 270 top
IC20  W5500  [LQFP48]  193.43,35.17 90 top
IC21  MIC5504-3.3YM5  [SOT23-5]  178.62,19.17 0 top
IC22  MCP6001RT-I/OT  [SOT23-5]  178.94,38.23 90 top
IC23  MCP9700AT-E/LT  [SC70-5]  164.41,6.1 90 top
IOVDD  DNI  [TP-ROUND]  162.54,10.71 90 bottom
J2  DNI  [SJ]  37.1,15.9 270 top
J7  DNI  [SJ]  39.76,15.9 270 top
J8  0R 1%  [0805]  116.25,21.35 90 top
J9  0R 1%  [0805]  208.07,48.04 270 top
J10  0R 1%  [0805]  205.71,48.06 270 top
K1  G2RL-1A-E DC12  [RELAY_G2RL-1A-E_DC5_OMR]  24.92,73.4 180 top
K2  G2RL-1A-E DC12  [RELAY_G2RL-1A-E_DC5_OMR]  48.54,73.7 180 top
K3  G2RL-1A-E DC12  [RELAY_G2RL-1A-E_DC5_OMR]  72.17,73.8 180 top
K4  G2RL-1A-E DC12  [RELAY_G2RL-1A-E_DC5_OMR]  96.2,73.6 180 top
K5  G2RL-1A-E DC12  [RELAY_G2RL-1A-E_DC5_OMR]  120.02,73.15 180 top
K6  G2RL-1A-E DC12  [RELAY_G2RL-1A-E_DC5_OMR]  144.44,73.55 180 top
K7  G2RL-1A-E DC12  [RELAY_G2RL-1A-E_DC5_OMR]  169.07,73.35 180 top
K8  G2RL-1A-E DC12  [RELAY_G2RL-1A-E_DC5_OMR]  193.8,73.05 180 top
L1  DNI  [SRR5228A]  110.56,12.15 0 top
L2  4.7uH 3.5A  [SRR5228A]  94.63,12.14 0 top
L3  1mH  [L-6.6X6.6]  25.88,29.61 0 top
L4  BLM18EG221TN1D  [0603]  188.02,29.98 0 top
L5  1mH  [L-6.6X6.6]  48.48,29.33 0 top
L-REC1  DNI  [TP-ROUND]  22.46,49.86 180 top
L-REC2  DNI  [TP-ROUND]  44.51,49.95 180 top
L_OUT1  FASTON-1217861-1  [1217861-1]  27.78,92.04 180 top
L_OUT2  FASTON-1217861-1  [1217861-1]  51.12,92.01 180 top
L_OUT3  FASTON-1217861-1  [1217861-1]  74.76,92.16 180 top
L_OUT4  FASTON-1217861-1  [1217861-1]  99.23,91.99 180 top
L_OUT5  FASTON-1217861-1  [1217861-1]  122.67,91.57 180 top
L_OUT6  FASTON-1217861-1  [1217861-1]  147.24,91.49 180 top
L_OUT7  FASTON-1217861-1  [1217861-1]  171.76,91.57 180 top
L_OUT8  FASTON-1217861-1  [1217861-1]  196.16,91.53 180 top
MCPVIN  DNI  [TP-ROUND]  134.2,21.8 0 bottom
MI  DNI  [TP-ROUND]  135.11,11.97 90 bottom
MISO1  DNI  [TP-ROUND]  203.71,40.58 0 bottom
MO  DNI  [TP-ROUND]  132.65,12.07 90 bottom
MOSI1  DNI  [TP-ROUND]  203.71,38.29 0 bottom
N_OUT1  FASTON-1217861-1  [1217861-1]  26.72,100.48 180 top
N_OUT2  FASTON-1217861-1  [1217861-1]  49.95,100.53 180 top
N_OUT3  FASTON-1217861-1  [1217861-1]  73.74,100.75 180 top
N_OUT4  FASTON-1217861-1  [1217861-1]  98.41,100.42 180 top
N_OUT5  FASTON-1217861-1  [1217861-1]  121.86,100.66 180 top
N_OUT6  FASTON-1217861-1  [1217861-1]  146.3,100.6 180 top
N_OUT7  FASTON-1217861-1  [1217861-1]  171.49,100.39 180 top
N_OUT8  FASTON-1217861-1  [1217861-1]  195.74,100.36 180 top
OPT1  ACPL-247-500E  [SO16]  168.65,48.15 180 top
OPT2  ACPL-247-500E  [SO16]  184.1,48 180 top
P3ON  Green  [LED-0603]  81.56,18.86 0 top
P5ON  DNI  [LED-0603]  81.56,15.82 0 top
P12ON  Green  [LED-0603]  81.56,12.67 0 top
PROC  Green  [LED-0603]  168.6,1.8 90 top
PWR  Green  [LED-0603]  161.78,36 270 top
R1  DNI  [0402]  99.3,8.6 270 top
R2  10K 1%  [0402]  84.15,9.59 180 top
R3  100K 1%  [0402]  100.06,10.85 0 top
R4  9.09K 1%  [0402]  102.16,11.55 90 top
R5  100K 1%  [0402]  84.13,10.94 0 top
R6  7.5K 1%  [0402]  86.23,11.54 90 top
R7  10R 1%  [0402]  106.96,14.15 270 top
R8  20K 1%  [0402]  102.16,14.65 90 top
R9  10R 1%  [0402]  91.03,14.14 270 top
R10  33K 1%  [0402]  86.23,14.64 90 top
R11  40.2K 1%  [0402]  102.16,17.35 270 top
R12  7.5K 1%  [0402]  100.96,14.65 270 top
R13  40.2K 1%  [0402]  86.23,17.74 270 top
R14  12.7K 1%  [0402]  85.03,14.64 270 top
R15  27R 1%  [0201]  162.69,20.02 225 top
R16  1K 1%  [0201]  152.49,13.3 315 top
R17  0R 1%  [2512]  161.01,47.96 90 top
R18  0R 1%  [2512]  156.52,47.91 90 top
R19  0R 1%  [2512]  151.84,47.93 90 top
R20  0R 1%  [2512]  147.24,47.93 90 top
R21  0R 1%  [2512]  142.64,47.93 90 top
R22  0R 1%  [2512]  138.04,47.93 90 top
R23  0R 1%  [2512]  133.44,47.93 90 top
R24  0R 1%  [2512]  128.84,47.93 90 top
R25  0.002R 1%  [2512]  15.26,100.54 0 bottom
R26  0.002R 1%  [2512]  110.21,100.57 0 bottom
R27  0.002R 1%  [2512]  134.46,100.67 0 bottom
R28  0.002R 1%  [2512]  159.42,100.59 0 bottom
R29  0.002R 1%  [2512]  184.16,100.44 0 bottom
R30  0.002R 1%  [2512]  86.46,100.72 0 bottom
R31  0.002R 1%  [2512]  62.31,100.77 0 bottom
R32  0.002R 1%  [2512]  38.56,100.67 0 bottom
R33  1K 1%  [0805]  13.38,96.18 270 top
R34  1K 1%  [0805]  17.14,96.18 270 top
R35  0.002R 1%  [2512]  15.27,100.51 180 top
R36  470K 1%  [0805]  16.25,81.84 0 top
R37  470K 1%  [0805]  16.22,79.71 180 top
R38  470K 1%  [0805]  16.23,77.4 180 top
R39  470K 1%  [0805]  12,77.52 180 top
R40  1K 1%  [0805]  12.03,79.77 0 top
R41  1K 1%  [0805]  107.98,96.4 270 top
R42  1K 1%  [0805]  112.24,96.38 270 top
R43  0.002R 1%  [2512]  110.21,100.54 180 top
R44  470K 1%  [0805]  111.38,81.7 180 top
R45  470K 1%  [0805]  111.42,79.66 180 top
R46  470K 1%  [0805]  111.38,77.48 180 top
R47  470K 1%  [0805]  107.36,77.5 180 top
R48  1K 1%  [0805]  107.38,79.62 0 top
R49  1K 1%  [0805]  36.68,96.38 270 top
R50  1K 1%  [0805]  40.44,96.38 270 top
R51  0.002R 1%  [2512]  38.56,100.64 180 top
R52  470K 1%  [0805]  39.98,82.1 180 top
R53  470K 1%  [0805]  40.02,79.96 180 top
R54  470K 1%  [0805]  40.03,77.93 180 top
R55  470K 1%  [0805]  35.94,77.9 180 top
R56  1K 1%  [0805]  35.94,82.12 0 top
R57  0R 1%  [0402]  164.5,39.56 180 top
R58  DNI  [0402]  164.51,40.77 180 top
R59  1K 1%  [0201]  171.5,53.6 270 top
R60  4.99K 1%  [0603]  30.58,41.11 90 top
R61  4.99K 1%  [0603]  29.78,38.51 180 top
R62  39R 1% 2W  [2512]  33.07,48.95 270 top
R63  1K 1%  [_0603X4-1206]  176.05,53.95 90 top
R64  1K 1%  [_0603X4-1206]  191.95,54.15 90 top
R65  1K 1%  [0805]  60.38,96.48 270 top
R66  1K 1%  [0805]  64.14,96.48 270 top
R67  0.002R 1%  [2512]  62.31,100.74 180 top
R68  470K 1%  [0805]  63.48,82.1 180 top
R69  470K 1%  [0805]  63.49,79.99 180 top
R70  470K 1%  [0805]  63.48,77.88 180 top
R71  470K 1%  [0805]  59.46,77.9 180 top
R72  1K 1%  [0805]  59.48,80.02 0 top
R73  1K 1%  [0805]  132.2,96.43 270 top
R74  1K 1%  [0805]  136.54,96.48 270 top
R75  0.002R 1%  [2512]  134.46,100.64 180 top
R76  470K 1%  [0805]  135.78,81.7 180 top
R77  470K 1%  [0805]  135.72,79.56 180 top
R78  470K 1%  [0805]  135.68,77.48 180 top
R79  470K 1%  [0805]  131.66,77.5 180 top
R80  1K 1%  [0805]  131.68,79.62 0 top
R81  1K 1%  [0805]  84.1,96.27 270 top
R82  1K 1%  [0805]  88.44,96.28 270 top
R83  0.002R 1%  [2512]  86.46,100.69 180 top
R84  470K 1%  [0805]  87.48,81.9 180 top
R85  470K 1%  [0805]  87.52,79.76 180 top
R86  470K 1%  [0805]  87.58,77.68 180 top
R87  470K 1%  [0805]  83.46,77.7 180 top
R88  1K 1%  [0805]  83.38,79.82 0 top
R89  10K 1%  [_0603X4-1206]  164.27,35.73 90 top
R90  10K 1%  [_0603X4-1206]  170.97,29.83 180 top
R91  0R 1%  [0402]  164.48,43.32 180 top
R92  DNI  [0402]  164.48,42.07 180 top
R93  10K 1%  [_0603X4-1206]  144.58,26.43 135 top
R94  100K 1%  [0402]  119.28,19.24 180 top
R95  10K 1%  [0402]  124.48,19.24 180 top
R96  10K 1%  [0805]  15.18,31.81 0 top
R97  1K 1%  [0805]  157.3,96.4 270 top
R98  1K 1%  [0805]  161.34,96.4 270 top
R99  0.002R 1%  [2512]  159.42,100.56 180 top
R100  470K 1%  [0805]  160.4,81.9 180 top
R101  470K 1%  [0805]  160.4,79.76 180 top
R102  470K 1%  [0805]  160.4,77.68 180 top
R103  470K 1%  [0805]  156.24,77.7 180 top
R104  1K 1%  [0805]  156.26,79.82 0 top
R105  4.99K 1%  [0603]  52.18,38.53 180 top
R106  39R 1% 2W  [2512]  54.03,48.98 270 top
R107  4.99K 1%  [0603]  53.08,41.33 90 top
R108  10K 1%  [0805]  37.48,30.93 0 top
R109  4.7K 1%  [0201]  139.46,18 0 top
R110  1M 1%  [1206]  203.3,13.18 270 top
R111  DNI  [R0201]  158.92,27.62 90 top
R112  1K 1%  [0402]  178.52,32 180 top
R113  1K 1%  [0805]  181.39,96.1 270 top
R114  1K 1%  [0805]  186.14,96.1 270 top
R115  0.002R 1%  [2512]  184.16,100.41 180 top
R116  470K 1%  [0805]  185.1,81.8 180 top
R117  470K 1%  [0805]  185.1,79.66 180 top
R118  470K 1%  [0805]  185.1,77.48 180 top
R119  470K 1%  [0805]  180.94,77.5 180 top
R120  1K 1%  [0805]  180.96,79.62 0 top
R121  2.2K 1%  [0201]  178.21,7.28 0 top
R122  1K 1%  [0402]  181.71,36.35 270 top
R123  1K 1%  [0402]  81.61,7.73 180 top
R124  5.1K 1%  [0201]  176.97,7.3 90 top
R125  5.1K 1%  [0201]  173.98,7.32 90 top
R126  10K 1%  [0201]  169.74,15.08 270 top
R127  10K 1%  [0201]  169.73,13.78 270 top
R128  DNI  [R0201]  158.17,27.64 90 top
R129  4.7K 1%  [0201]  157.02,27.36 0 top
R130  1.2K 1%  [0402]  137.58,11.11 270 top
R131  1M 1%  [0402]  169.23,6.75 90 top
R132  10K 1%  [0402]  178.47,27.68 0 top
R133  3.3R 1%  [0201]  191.1,26.31 270 top
R134  3.3R 1%  [0201]  190.34,26.3 270 top
R135  3.3R 1%  [0201]  194.04,27.61 270 top
R136  3.3R 1%  [0201]  193.31,27.6 270 top
R137  49.9R 1%  [0201]  192.58,27.6 270 top
R138  49.9R 1%  [0201]  194.77,27.61 270 top
R139  49.9R 1%  [0201]  191.84,27.61 90 top
R140  49.9R 1%  [0201]  189.61,27.59 90 top
R141  470R 1%  [0402]  197.39,19.49 270 top
R142  470R 1%  [0402]  186.99,19.79 270 top
R143  12.4K 1%  [0201]  197.1,30.44 90 top
R144  1M 1%  [0201]  193.42,41.91 180 top
R145  4.7K 1%  [0201]  188.97,38.96 180 top
R146  470R 1%  [0402]  188.2,27.24 90 top
R147  1K 1%  [0402]  147.11,5.17 90 top
R148  2.4K 1%  [0402]  96.14,20.17 180 top
R149  DNI  [_0603X4-1206]  125.03,12.19 270 top
R150  8.2K 1%  [0402]  113.56,20.24 180 top
R151  1K 1%  [0402]  164.48,38.36 180 top
R152  10R 1%  [0201]  136.5,21.4 0 top
R153  1K 1%  [0201]  169,53.6 270 top
R154  1K 1%  [0201]  166.4,53.6 270 top
R155  1K 1%  [0201]  163.9,53.6 270 top
R156  1K 1%  [0201]  186.9,53.6 270 top
R157  1K 1%  [0201]  184.5,53.6 270 top
R158  1K 1%  [0201]  181.8,53.5 270 top
R159  1K 1%  [0201]  179.3,53.5 270 top
R160  27R 1%  [0201]  162.19,20.52 225 top
R161  DNI  [0402]  105.7,16.3 270 top
R162  10K 1%  [0402]  101.3,9.5 0 top
R163  1K 1%  [0402]  166.76,6.74 90 top
R164  10K 1%  [0402]  126.13,24.99 90 top
R165  DNI  [R0201]  128.39,23.22 0 top
R166  1.2K 1%  [0402]  139.3,11.1 270 top
R167  1.2K 1%  [0402]  153.26,24.29 270 top
R168  1.2K 1%  [0402]  155.38,24.3 270 top
R169  0R 1%  [1206]  146.97,22.01 0 top
R170  DNI  [1206]  175.17,2.42 0 bottom
R171  33K 1%  [0402]  83.57,7.75 270 top
R172  DNI  [0402]  81.71,10.21 90 top
REF1  LM4040x30  [SOT23]  136.97,17.76 180 top
REL0  DNI  [TP-ROUND]  153.18,38.4 270 bottom
REL1  DNI  [TP-ROUND]  150.84,38.4 270 bottom
REL2  DNI  [TP-ROUND]  148.51,38.4 270 bottom
REL3  DNI  [TP-ROUND]  146.21,38.4 270 bottom
REL4  DNI  [TP-ROUND]  143.88,38.4 90 bottom
REL5  DNI  [TP-ROUND]  141.59,38.4 270 bottom
REL6  DNI  [TP-ROUND]  139.29,38.4 270 bottom
REL7  DNI  [TP-ROUND]  136.99,38.4 270 bottom
RES  B3U-1000P  [B3U-1000P]  182.72,27.63 180 top
RGTG  DNI  [1X4]  182.2,23.99 90 top
RN1  100K 1%  [_0603X4-1206]  149.4,41.05 180 top
RN2  100K 1%  [_0603X4-1206]  140.84,40.98 180 top
RST  DNI  [TP-ROUND]  157,7.2 0 bottom
RX0  DNI  [TP-ROUND]  158.64,42.15 0 bottom
SC  DNI  [TP-ROUND]  130.27,12.07 90 bottom
SCL0  DNI  [TP-ROUND]  141.31,15.5 0 bottom
SCL1  DNI  [TP-ROUND]  156.85,32.08 0 bottom
SCLK1  DNI  [TP-ROUND]  203.71,42.87 0 bottom
SDA0  DNI  [TP-ROUND]  141.32,13.23 0 bottom
SDA1  DNI  [TP-ROUND]  154.85,30.46 0 bottom
SW  DNI  [TP-ROUND]  109.66,17.99 180 bottom
SW3  DNI  [TP-ROUND]  93.83,17.84 180 bottom
T1  BSS138  [SOT23]  128.33,25.7 0 top
TX0  DNI  [TP-ROUND]  158.72,38.68 0 bottom
U$1  DNI  [ESD_10.00]  102.6,70.42 0 bottom
U$2  DNI  [ESD_10.00]  3.67,62.92 0 top
U$3  DNI  [3,2]  205.47,103.26 0 top
U$4  DNI  [3,2]  4.77,103.26 0 top
U$5  DNI  [DMT]  19.4,15.2 0 top
U$6  DNI  [3,2]  4.6,6.5 0 top
U$7  DNI  [DMT]  59,44.8 0 bottom
U$10  DNI  [OSHW-LOGO-M]  129.85,40.09 0 top
U$11  DNI  [ROHS_LOGO_0.18_IN]  198.81,22.65 0 top
U$12  DNI  [CE_5MM]  60.4,32.7 0 bottom
U$13  DNI  [NO_PB_LOGO_0.120]  56.5,27.1 0 bottom
U$14  DNI  [ROHS_LOGO_0.18_IN]  56.7,20.6 0 bottom
U$15  DNI  [SMOKE]  98.88,40.15 0 bottom
USB1  USB-TYPE-C-018  [USB-C]  175.15,2.41 0 top
UTX  DNI  [TP-ROUND]  167.6,41.2 180 bottom
VBUS  DNI  [TP-ROUND]  168.08,15.36 180 bottom
VCC  DNI  [TP-ROUND]  27.18,35.01 90 top
VCC2  DNI  [TP-ROUND]  49.38,35.03 270 top
VREF  DNI  [TP-ROUND]  141.3,20.39 0 bottom
X1  12MHz  [WE-XTAL_CFPX-180]  150.03,11.69 315 top
X2  25MHz  [WE-XTAL_CFPX-180]  193.41,44.11 0 top

## Tracks (layer width: path | path; a pad name or v marks a point on that pad's centre or on a via)
3V3_EN  (via drill 0.2)
  L1-GND/SIG 0.2: R171.1 83.57,9.52 R2.2
  L1-GND/SIG 0.203: 83.57,9.52 83.53,9.56 v82.7,9.56 R172.1 | IC2.6 88.76,14.31 v89.18,14.73
  L5-SIG_LS/AC_L 0.203: v82.7,9.56 82.7,9.61 83.92,10.83 87.7,10.83 89.18,12.31 v89.18,14.73
3VFB  (via drill 0.2)
  L1-GND/SIG 0.152: 86.5,17.09 86.3,17.09 R13.2
  L1-GND/SIG 0.203: 86.3,17.09 C12.2 R14.1 R10.2 v86.23,16.17 R13.2
  L3-GND/AC_L 0.203: 3VFB.TP 88.82,19.44 86.23,16.85 v86.23,16.17
  pour L1-GND/SIG (isolate 0.254, rank 4, no thermals): 84.2,17.6 87,17.6 87,14.8 84.2,14.8
5V_EN  (via drill 0.2)
  L1-GND/SIG 0.305: IC1.6 104.68,14.19 104.83,14.34 v105.07,14.58 | R161.2 105.7,15.21 v105.07,14.58 | R162.1 99.55,9.5 R1.1 98.48,9.25 v98.46,9.23 | v105.07,14.58
  L2-SIG-HS/AGND 0.305: v98.46,9.23 99.58,10.35 103.21,10.35 104.85,11.99 104.85,14.36 v105.07,14.58
5VFB  (via drill 0.2)
  L1-GND/SIG 0.203: C11.2 101.53,16.13 | 101.53,16.13 v101.53,15.98 101.53,15.93 | R11.2 101.58,16.13 101.53,16.13 | R8.2 101.53,15.93 | R12.1 101.53,15.87 101.53,15.93
  L1-GND/SIG 0.305: 100.58,15.68 R12.1
  L3-GND/AC_L 0.203: 5VFB.TP 101.23,15.68 v101.53,15.98
  pour L1-GND/SIG (isolate 0.254, rank 4, no thermals): 100.2,17.2 103,17.2 103,14.8 100.2,14.8
12VRAW  (via drill 0.2)
  L1-GND/SIG 0.61: 116.6,27.5 v115.6,27.5 | C13.1 115.54,35.16 v115.5,35.2 | C10.1 115.54,42.66 v115.5,42.7 | C10.1 120.14,42.66 v120.2,42.6 | C13.1 120.06,35.16 v120.1,35.2 | C16.1 120.06,27.56 v120.1,27.6 | J8.2 116.25,23.55 v116.3,23.6 | D16.C 118.12,21.82 v118.1,21.8 | J8.2 116.45,22.5 v117.4,22.5 | J8.2 116.05,22.5 v115.1,22.5 | C16.1 116.76,27.56 116.7,27.5 116.6,27.5 | C16.1 116.6,27.56 v116.6,28.9 | 116.6,27.5 v116.6,26.3 | C13.1 116.6,35.16 | 116.6,35.16 v116.6,36.5 | 116.6,35.16 v116.6,33.8 | C10.1 116.6,42.66 | 116.6,42.66 v116.6,43.9 | 116.6,42.66 v116.6,41.4 | v205.7,46 205.72,46 J10.2 206.9,47.11 | v208.1,46 208.07,46 J9.2 208.07,47.11 206.9,47.11 | 206.9,47.11 v206.9,46
  L2-SIG-HS/AGND 0.2: v127.09,21.43 126.21,21.43 126.1,21.32 118.58,21.32 v118.1,21.8
  L3-GND/AC_L 0.203: v127.09,21.43 127,21.34 124.37,21.34 12VDC.TP
  pour L4-PWR/AGND (isolate 0.254, rank 4, no thermals): 113.6,22 113.6,27 112.2,28.4 110.6,28.4 108.8,30.2 108.8,47 120.8,47 120.8,21.6 114,21.6
  pour L4-PWR/AGND (isolate 0.254, rank 4, no thermals): 108.6,47 124.25,47 arc-90 124.75,46.5 190.25,46.5 arc90 190.75,47 203.8,47 204.4,47.6 209.6,47.6 209.6,44.4 114.5,44 114.5,28.5 110.5,28.5 108.6,30.4
  pour L1-GND/SIG (isolate 0.254, rank 4, no thermals): 204,47 204,45.7 209.5,45.7 209.5,47.5 204.5,47.5
!ACT  (via drill 0.2)
  L1-GND/SIG 0.148: IC20.27 195.19,38.22 v195.1,38.13 | v187.24,21.36 187.24,20.69 R142.1
  L5-SIG_LS/AC_L 0.148: v195.1,38.13 195.1,33.66 190.08,28.64 190.08,28.28 189.8,28 188.93,28 187.71,26.78 187.71,22.46 187.24,21.99 v187.24,21.36
!LINK  (via drill 0.2)
  L1-GND/SIG 0.148: IC20.25 196.19,38.16 v196.17,38.14 | v197.4,21.08 197.4,20.16 R141.1
  L5-SIG_LS/AC_L 0.148: v196.17,38.14 195.77,37.74 195.77,29.14 197.4,27.51 v197.4,21.08
!QSPI_SS  (via drill 0.2)
  L1-GND/SIG 0.15: IC15.56 157.84,21.02 v157.84,21.19 | IC18.1 160.57,27 v159.7,27 159.26,27 R111.1
  L1-GND/SIG 0.2: R112.2 177.1,32 v177.05,31.95
  L2-SIG-HS/AGND 0.2: v177.05,31.95 176.59,31.49 176.59,28.56 167.33,28.56 166.32,27.55 160.25,27.55 v159.7,27
  L5-SIG_LS/AC_L 0.149: v157.84,21.19 159.03,22.38 159.03,25.62 159.7,26.29 v159.7,27
!TX_OUT  (via drill 0.2)
  L1-GND/SIG 0.203: IC9.6 169.39,37.85 v169.24,37.7 | R92.1 165.83,42.07 v165.9,42 | IC22.3 179.46,39.18 v179.05,38.77
  L2-SIG-HS/AGND 0.203: v165.9,42 166.9,41 168.5,41 169.24,40.26 v169.24,37.7 169.88,37.06 173.6,37.06 175.1,38.56 178.84,38.56 v179.05,38.77
!W5500_CS  (via drill 0.2)
  L1-GND/SIG 0.148: IC20.32 192.69,41.17 192.41,41.45 191.01,41.45 190.61,41.85 190.61,42.85 v190.53,42.93
  L1-GND/SIG 0.149: v156.71,11.85 156.36,11.85 IC15.28
  L5-SIG_LS/AC_L 0.15: v156.71,11.85 156.63,11.77 156.63,11.3 157.17,10.76 158.38,10.76 158.46,10.84 162.23,10.84 185.48,34.09 185.48,37.55 188.17,40.23 188.97,40.23 190.53,41.8 v190.53,42.93
  L5-SIG_LS/AC_L 0.203: v202.8,36.89 203.11,37.2 203.11,41.22 201.93,42.4 195.23,42.4 194.7,42.93 v190.53,42.93
  L3-GND/AC_L 0.2: CS1.TP 202.82,36.89 v202.8,36.89
!W5500_INT  (via drill 0.2)
  L1-GND/SIG 0.148: IC20.36 190.61,39.43 190.61,39.95 190.47,40.09 190.44,40.09 189.69,40.84 188.38,40.84 v187.9,41.33
  L1-GND/SIG 0.149: IC15.32 157.67,13.41 v157.67,13.44
  L5-SIG_LS/AC_L 0.15: v157.67,13.44 158.68,12.43 158.75,12.43 159.09,12.09 161.71,12.09 184.23,34.61 184.23,38.58 185.45,39.8 186.37,39.8 v187.9,41.33
!W5500_RST  (via drill 0.2)
  L1-GND/SIG 0.148: R145.1 189.25,38.94 IC20.37
  L1-GND/SIG 0.149: IC15.31 158.54,11.98 v158.56,11.98
  L1-GND/SIG 0.15: R145.1 189.62,38.96 189.93,39.27 v189.93,39.44
  L2-SIG-HS/AGND 0.15: v185.6,39.26 185.88,39.54 189.83,39.54 v189.93,39.44
  L5-SIG_LS/AC_L 0.15: v158.56,11.98 158.77,11.78 161.84,11.78 184.54,34.48 184.54,37.99 185.6,39.05 v185.6,39.26
+1V1  (via drill 0.2)
  L1-GND/SIG 0.149: IC15.45 161.02,17.98 v161.08,17.98 v161.07,17.99 C75.1 | IC15.23 154.33,12.99 v154.33,12.59 154.28,12.59 C76.1 | C77.1 159.76,19.46 v159.61,19.46
  L1-GND/SIG 0.15: IC15.50 159.61,19.41 v159.61,19.46
  L4-PWR/AGND 0.203: v154.33,12.59 154.41,12.51 156.19,12.51 156.64,12.96 156.64,13.48 160.2,17.04 | 160.2,17.04 160.21,17.04 | 160.2,17.04 161.08,17.92 v161.08,17.98
  L5-SIG_LS/AC_L 0.2: v159.61,19.46 160.45,19.46 161.35,18.56 | v161.08,17.98 161.34,18.24 161.34,18.56 161.35,18.56 | 161.35,18.56 161.96,18.56 162.98,17.54 165.23,17.54 DVDD.TP
  other vias: 165.9,18.21
+3V3  (via drill 0.2)
  L1-GND/SIG 0.148: C90.1 v188.08,34.92 v188.09,34.91 IC20.43 IC20.44 IC20.45 v188.1,33.91 | v188.1,33.91 v188.09,33.92 | v188.1,33.91 C89.1 | L4.1 v187.17,30.96 | L4.1 v187.17,29.02 v187.16,29.01 | L4.1 186.31,29.98 v186.29,29.96 | R145.2 v188.11,38.95 | IC20.28 194.69,41.08 C88.1 195.36,41.17 v195.39,41.14 | v165.82,7.07 v165.81,7.06 IC23.4 165.06,7.2 165.04,7.21 C105.1 165.04,8.84 v165.07,8.86
  L1-GND/SIG 0.149: 141.23,5.99 v141.2,6.02 | v140.78,5.5 140.76,5.48 140.75,5.48
  L1-GND/SIG 0.15: R147.2 v147.11,6.72
  L1-GND/SIG 0.152: R89.D2 R89.C2 R89.B2 R89.A2 163.45,34.51 v163.45,33.77 | v85.03,19.13 C12.1 R13.1 86.2,18.42 v86.2,19.13
  L1-GND/SIG 0.2: R90.A2 R90.B2 R90.C2 R90.D2 169.83,28.96 v169.83,28.05 | R90.A2 172.94,29.03 v172.96,29.05 | R90.A2 172.17,28.04 v172.18,28.03 | C20.1 152.66,29.61 v153.22,30.16 | C19.1 151.67,28.61 v151.18,28.11
  L1-GND/SIG 0.203: IC9.16 v173.19,32.81 v173.2,32.8 | v173.3,34.6 173.33,34.63 C34.1 C33.1 173.99,33.5 v173.3,33.5 | IC22.2 181.44,38.23 C103.1 181.59,39 v181.54,39.05 | R169.1 v144.24,22.01 | R169.1 145.55,23.28 v145.56,23.29 | R169.1 v145.55,20.71 | L2.2 94.53,10.29 v94.53,8.99 | C15.1 94.61,8.99 v94.53,8.99 | C18.1 94.53,8.96 v94.53,8.99
  L1-GND/SIG 0.305: C19.1 152.1,29.24 | 152.1,29.24 152.46,29.61 C20.1 | IC4.5 152.08,29.24 152.1,29.24
  L1-GND/SIG 0.406: v140.78,5.5 140.81,5.5 141.23,5.92 141.23,5.99 | DSP.1 141.2,7.12 v141.2,6.02 | 140.75,5.48 140.75,4.37 DSP.2 | R123.1 82.33,7.66 v82.33,6.6
  L1-GND/SIG 0.508: v124.25,10.12 124.23,10.14 R149.D1 R149.C1 R149.B1 R149.A1 124.23,14.11 v124.26,14.14
  L1-GND/SIG 0.61: C15.1 95.92,7.67 v97.46,7.67
  L4-PWR/AGND 0.61: v140.78,5.5 v140.78,5.51 141.2,5.93 v141.2,6.02 141.2,7.81 139.53,9.48 131.1,9.48 129.79,10.79 127.37,10.79 125.24,12.92 114.32,12.92 106.12,4.72 100.32,4.72 97.46,7.58 v97.46,7.67
  L3-GND/AC_L 0.203: 3VDC.TP 94.53,8.79 v94.53,8.99
  pour L1-GND/SIG (isolate 0.305, rank 4, no thermals): 92,11.4 92,6.8 97.4,6.8 97.4,11.4
  pour L4-PWR/AGND (isolate 0.203, rank 6, no thermals): 79.5,47.25 79.5,-1 212,-1 212,47 191,47 arc-90 190.5,46.5 125.25,46.5 arc90 124.75,47 108.4,47
+3V3_A  (via drill 0.2)  (1 unrouted)
  L1-GND/SIG 0.148: IC20.4 192.19,29.63 | 192.19,29.63 C96.1 | IC20.8 194.19,29.51 C93.1 193.71,29.42 v193.54,29.59 | IC20.11 195.69,29.98 195.91,29.75 C91.1 v196.45,29.42 | IC20.15 198.74,33.42 198.88,33.28 C92.1 v200.28,33.28 | IC20.17 198.84,34.42 199.02,34.6 199.65,34.6 C94.1 200.25,34.59 v200.26,34.6 | IC20.21 v198.98,36.42 199.15,36.42 C95.1 | R140.2 v189.61,28.47 | R146.2 v188.2,28.67 | R139.2 191.84,28.4 v191.86,28.42 192.19,28.75 192.19,29.63 | L4.2 v189.75,29.98 v189.76,29.97 | L4.2 188.95,30.06 v188.95,30.92 | L4.2 188.98,29.86 v188.98,29.01
  L1-GND/SIG 0.203: IC20.15 196.47,33.41 v196.39,33.49 | IC20.17 v196.4,34.42 v196.39,34.43
  pour L4-PWR/AGND (isolate 0.254): 188.03,29.39 188.03,30.97 188.75,31.69 195.69,38.63 200.09,38.63 201.75,36.97 201.75,34.5 201.75,32.34 200.38,30.97 200.38,27.23 197.71,24.56 197.34,24.19 188.35,24.19 187.29,25.25 187.29,28.17 187.29,28.45 188.03,29.19 188.03,29.32
+3V3_MCU  (via drill 0.2)
  L1-GND/SIG 0.149: IC15.44 161.07,17.47 161.22,17.47 161.32,17.57 v161.63,17.57 161.65,17.55 C70.1 | v161.41,16.19 161.41,16.06 IC15.42 161.39,15.35 161.49,15.35 161.51,15.33 v161.73,15.33 162.11,15.71 C69.1 | IC15.33 159.06,12.6 v159.25,12.6 | IC15.22 153.88,13.1 v153.85,13.1 153.79,13.1 C101.1 | C71.1 160.25,18.93 v160.09,18.93 | IC19.8 158.16,22.98 v158.37,22.78 | R128.2 v158.17,28.49
  L1-GND/SIG 0.15: IC15.1 156.69,20.05 v156.69,19.91 | IC15.10 153.05,18.61 v153.05,18.65 | IC15.49 159.46,18.46 IC15.48 | IC15.48 | C67.1 167.71,27.03 v167.18,27.03 IC18.8 165.99,27.34 v165.99,28.13 165.44,28.13 C64.1 | v158.92,28.51 R111.2 158.9,27.91 R128.2 | v158.92,28.51 | R167.1 153.26,25.69 v153.24,25.71 | R168.1 v155.38,25.71 | C68.1 159.29,12.6 v159.25,12.6 | R165.2 128.84,23.22 v129.25,22.81 | v135.57,21.45 136.18,21.45 R152.1 | C104.1 133.82,22.9 v133.73,22.81 | R109.2 v140.29,18
  L1-GND/SIG 0.152: C73.1 155.89,21.22 155.89,20.85 IC15.1 | v153.05,18.65 152.77,18.65 C72.1 | PWR.A 161.85,35.18 v161.85,34.57
  L1-GND/SIG 0.2: R132.1 177.15,28.35 v177.11,28.35 | R166.1 R130.1 v137.58,12.49 v137.59,12.5
  L1-GND/SIG 0.203: R169.2 148.62,21.78 v148.62,20.67 | R169.2 v149.65,22.01 | R169.2 148.62,22.24 v148.62,23.31
  L1-GND/SIG 0.305: v174.65,20.19 175.71,20.19 C99.1 176.15,20.44 v176.98,20.44 177.01,20.47 IC21.5 177.95,20.19 v178.59,20.19 | C100.1 v178.59,20.19 | v178.59,20.19
  L1-GND/SIG 0.406: 159.46,18.46 159.93,18.93 v160.09,18.93
  L4-PWR/AGND 0.15: v129.25,22.81 v133.73,22.81 134.97,22.81 135.6,22.18 135.6,21.48 v135.57,21.45
  L4-PWR/AGND 0.152: v161.85,34.57 161.85,32.79 161.82,32.76 161.84,32.74 v161.84,32.71
  L4-PWR/AGND 0.2: v177.11,28.35 175.8,27.04 167.18,27.04 v167.18,27.03 | v137.59,12.5 138.1,13.01 138.1,15.46 138.67,16.03 138.67,18 | v153.85,13.1 153.64,12.9 153.64,11.94 154.5,11.08 156.61,11.08 158.31,12.78 159.03,12.78 | 159.03,12.78 159.06,12.78 v159.25,12.6 | v161.73,15.33 161.09,15.33 159.03,13.27 159.03,12.78
  L4-PWR/AGND 0.254: v135.57,21.45 135.66,21.36 135.66,20.25 137.91,18 138.67,18 v140.29,18 147.61,18 147.65,18.04 151.54,18.04 C72.1 152.77,18.65 v153.05,18.65
  L3-GND/AC_L 0.2: 162.45,10.71 IOVDD.TP 161.9,10.07 v161.9,9.15
  pour L4-PWR/AGND (isolate 0.203, rank 5, no thermals): 147,15 147,23 152,28 153,28 158,33 166,33 169,30 169,24 172,21 178,21 179,20 179,18.73 171.73,18.73 162,9 153,9
+5V  (via drill 0.2)
  L1-GND/SIG 0.149: 139.74,4.49 DSP.4
  L1-GND/SIG 0.2: R148.1 96.79,18.63 v96.76,18.6
  L1-GND/SIG 0.305: C11.1 R11.1 v103.06,18 | v103.06,18 | L1.2 108.2,10.4 v107.97,10.63 | v116.91,9.51
  L1-GND/SIG 0.406: DSP.3 140.19,7.11 v140.19,6.03 | v139.75,5.49 139.75,4.5 139.74,4.49
  L1-GND/SIG 0.508: D15.A v116.91,9.51
  L2-SIG-HS/AGND 0.2: v96.76,18.6 102.46,18.6 v103.06,18
  L2-SIG-HS/AGND 0.305: v103.06,18 108.01,13.05 108.01,10.67 v107.97,10.63
  L4-PWR/AGND 0.61: v116.91,9.51 116.91,10.69 117.98,11.76 124.88,11.76 127.21,9.43 129.4,9.43 131.58,7.25 139.6,7.25 140.19,6.66 v140.19,6.03 140.19,6.01 139.75,5.57 v139.75,5.49
  L3-GND/AC_L 0.203: 5VDC.TP 116.88,9.48 v116.91,9.51
  pour L1-GND/SIG (isolate 0.305, rank 4, no thermals): 107.8,11.2 107.8,6.9 119.2,6.9 119.2,13.4 115.9,13.4 115.9,11.2
+5V_MEA  (via drill 0.2, 0.4)
  L1-GND/SIG 0.254: R63.D1 R63.C1 R63.B1 R63.A1 | R64.D1 R64.C1 R64.B1 R64.A1
  L1-GND/SIG 0.508: R63.D1 176.9,55.1 v176.9,51.4 | R64.D1 192.75,51.35 v192.8,51.3 | IC6.1 10.56,88.66 v10.7,88.8 | IC8.1 34.6,88.8 v34.5,88.9 | IC10.1 58.2,88.07 v58.2,89 | IC12.1 81.5,88.16 v81.5,88.9 | IC7.1 105.7,87.74 v105.7,88.7 | IC11.1 129.7,87.68 v129.7,88.6 | IC14.1 154.4,87.75 v154.4,88.8 | IC16.1 178.9,87.8 v178.9,88.9 | v34.8,66.3 35,66.1 v35,64.2 | v58.2,67.1 58.4,66.9 v58.4,64.2 | v81.6,67.9 81.6,65.3 v82.3,64.6 | v105.6,68.5 106.8,67.3 v106.8,64.4 | v129.7,69.3 129.7,64.7 v129.9,64.5 | v154.3,70 154.5,69.8 v154.5,64.5 | v176.8,70.8 176.8,68 176,67.2 v174.9,67.2
  L1-GND/SIG 0.61: J7.2 J2.2 37.1,13.6 v37,13.5
  L3-GND/SIG 0.508: v10.7,88.8 10.7,84.5 14.8,80.4 14.8,70 20.6,64.2 v35,64.2 v58.4,64.2 61.5,64.2 62.3,63.4 62.3,51.4 | v34.5,88.9 34.5,66.6 v34.8,66.3 | v58.2,89 v58.2,67.1 | v81.5,88.9 81.5,68 v81.6,67.9 | v105.7,88.7 105.7,68.6 v105.6,68.5 | v129.7,88.6 v129.7,69.3 | v154.4,88.8 154.4,70.1 v154.3,70 | v178.9,88.9 178.9,85.7 176.8,83.6 v176.8,70.8 | v82.3,64.6 83,63.9 83,51.4 | v106.8,64.4 106.8,51.5 106.9,51.4 | v129.9,64.5 130.6,63.8 130.6,51.4 | v154.5,64.5 154.5,51.6 154.7,51.4 | v174.9,67.2 176.9,65.2 v176.9,51.4
  L3-GND/SIG 1.27: v59,29.5 59,48.1 62.3,51.4 83,51.4 106.9,51.4 130.6,51.4 154.7,51.4 v176.9,51.4 192.7,51.4 v192.8,51.3
  other vias: 35,13.5 33,13.5 39,13.5 41,13.5 43,13.5 45,13.5 59,27.5 59,25.5 59,23.5 59,21.5
  pour L1-GND/SIG (isolate 0.406, no thermals): 23,14.5 23,15 52,15 56,19 57.5,20.5 57.5,29.5 58,30 61,30 61,20 60.5,19.5 53,12 23.5,12 23,12
  pour L3-GND/SIG (isolate 0.406, no thermals): 23,14.5 23,15 52,15 56,19 57.5,20.5 57.5,29.5 58,30 61,30 61,20 60.5,19.5 53,12 23.5,12 23,12
+5V_MEA1  (via drill 0.4)
  L1-GND/SIG 0.508: L3.2 30.91,27.31 D9.A
  L1-GND/SIG 0.61: J2.1 34.34,16.66 v34.3,16.7
  other vias: 32.8,16.7 34.3,18.2 35.8,18.2 12.8,33.7 12.8,35.2 12.8,36.7 12.8,32.2 12.8,30.7 23.8,20.7 25.8,20.7 27.8,20.7 29.8,20.7 28.8,21.7 26.8,21.7 24.8,21.7 23.8,22.7 25.8,22.7 27.8,22.7 29.8,22.7
  pour L3-GND/SIG (isolate 0.813, no thermals): 11.7,36.6 11.7,27.5 23,16.2 37.3,16.2 37.3,19.2 19.4,37.1 12.2,37.1
  pour L1-GND/SIG (isolate 0.254, no thermals): 15.78,25.15 19.51,25.15 20.09,25.73 20.09,31.94 20.38,32.23 21.48,32.23 21.57,32.14 21.57,28.92 32.62,28.92 33.49,28.05 33.49,22.71 30.94,20.16 15.26,20.16 15.26,24.99
  pour L1-GND/SIG (isolate 0.813, no thermals): 34.2,19.5 32.7,18 32.7,16 37.5,16 38,16.5 38,19 36,19 35.5,19.5
  pour L1-GND/SIG (isolate 0.406, no thermals): 12.1,37.1 11.7,36.7 11.7,29.5 13.8,29.5 14.7,30.4 14.9,30.6 14.9,36.9 14.6,37.2 12.2,37.2
+5V_MEA2  (via drill 0.4)
  L1-GND/SIG 0.508: L5.2 53.6,26.93 D13.A
  L1-GND/SIG 0.61: J7.1 41.56,16.66 v41.7,16.8
  other vias: 41.7,18.3 40.2,18.3 41.7,19.8 35.2,29.8 35.2,31.3 35.2,32.8 35.2,34.3 36.7,34.3 36.7,32.8
  pour L3-GND/SIG (isolate 0.813, no thermals): 34.5,37.4 34.5,25.2 38.8,20.9 38.8,16.1 49.8,16.1 49.8,33.6 45.2,38.2 35.3,38.2
  pour L1-GND/SIG (isolate 0.254, no thermals): 37.77,24.7 41.5,24.7 42.08,25.28 42.08,31.49 42.37,31.78 43.47,31.78 43.56,31.69 43.56,28.47 54.61,28.47 55.48,27.6 55.48,21.56 53.63,19.71 43,19.7 43,16.5 39,16.5 39,19.71 37.25,19.71 37.25,24.54
  pour L1-GND/SIG (isolate 0.406, no thermals): 35,36.5 34.5,36 34.5,28.8 36.6,28.8 36.9,29.1 36.9,36.5
+12V  (via drill 0.2)  (1 unrouted)
  L1-GND/SIG 0.2: R171.2 84.65,7.1 85.19,7.64 | 88.11,9.47 IC2.2
  L1-GND/SIG 0.203: v132.8,36.1 131.24,36.1 IC3.10 129.73,36.13 v129.7,36.1
  L1-GND/SIG 0.61: R150.1 v115,20.24 116.09,20.24 J8.1 | J8.1 116.2,20.35 v116.2,19.3 | J8.1 116.45,20.2 v117.5,20.2 | R94.2 117.84,19.24 v117.8,19.2 | C3.1 v103.12,9.45 102,9.45 R162.2 | C1.1 100.77,7.65 v100.75,7.67 | C2.1 85.19,7.64 v85.08,7.53 | 88.11,9.47 87.48,8.84 v87.42,8.84
  L1-GND/SIG 1.016: J10.1 207.1,49.01 | 207.1,49.01 208.05,49.01 J9.1 | K1.8 23.54,58.2 33.25,58.2 | 33.25,58.2 D1.C | K2.8 44.73,58.2 | D3.C 72.35,57.04 K3.8 68.36,63.22 | D4.C 96.34,56.87 K4.8 92.39,63.21 92.4,63.22 | D5.C 119.49,57.09 K5.8 116.21,63.11 116.1,63.22 | 144.22,60.77 K6.8 136.82,60.77 134.38,63.22 116.1,63.22 | D6.C 148.41,56.59 144.22,60.77 | K7.8 167.75,58.08 D7.C 189.99,58.08 K8.8 189.99,58.03 202.53,58.03 D8.C 205.56,57.73 206.9,56.4 206.9,49.21 207.1,49.01 | 116.1,63.22 92.4,63.22 | 92.4,63.22 68.36,63.22 | 68.36,63.22 65.22,63.22 59.52,57.52 D2.C 48.14,57.52 47.46,58.2 44.73,58.2 | 33.25,58.2 44.73,58.2 | 144.22,60.77 144.22,61.42 145.8,63 156.4,63 160.4,67 v166.3,67 | C1.1 101.66,7.65 v101.64,7.67
  L3-GND/SIG 1.016: v166.3,67 166.3,61.61 K7.8
  L4-PWR/AGND 0.148: 86.24,7.58 v86.07,7.58
  L4-PWR/AGND 0.61: v132.8,36.1 v129.7,36.1 128.3,36.1 127.22,35.02 FAN.2
  L4-PWR/AGND 1.016: FAN.2 124.83,32.74 121.89,29.8 121.89,21.18 121.19,20.48 118.5,20.48 118.22,20.2 v117.5,20.2 | v115,20.24 115,18.8 114.73,18.53 113.64,19.62 102.17,19.62 | v86.07,7.58 86.24,7.75 87.74,7.75 87.74,10.44 90.46,13.16 90.46,15.95 94.13,19.62 102.17,19.62 | 86.31,7.65 86.24,7.58 | v101.64,7.67 101.64,9.33 103.07,10.76 103.07,16.73 102.17,17.63 102.17,19.62
  pour L1-GND/SIG (isolate 0.254, rank 3, no thermals): 88.3,11.5 88.3,6.7 88,6.4 84.6,6.4 84.5,6.5 84.5,8.3 84.8,8.6 86.8,8.6 88,9.8 88,11.5
  pour L1-GND/SIG (isolate 0.254, rank 3, no thermals): 104.2,11.6 104.2,6.8 103.9,6.5 100.5,6.5 100.4,6.6 100.4,8.4 100.7,8.7 101.6,8.7 101.6,11.6
  pour L4-PWR/AGND (isolate 0.254, rank 3, no thermals): 118.9,20.9 118.9,17 113.6,17 113.5,17.1 113.5,20.9
+12V_MEA  (via drill 0.2)
  L1-GND/SIG 0.149: IC15.41 161.56,14.62 v161.69,14.62
  L1-GND/SIG 0.61: R94.1 v121.9,19.24 R95.2
  L2-SIG-HS/AGND 0.152: v146.85,14.95 145.52,16.27 v145.48,16.23
  L5-SIG_LS/AC_L 0.152: v161.69,14.62 160.89,15.42 159.66,15.42 159.48,15.61 158.84,15.61 158.31,15.07 158.31,15.06 157.09,13.84 156.22,13.84 155.57,14.49 154,14.51 153.5,15 152.9,15 152.34,14.44 151.12,14.44 150.47,15.09 146.99,15.09 v146.85,14.95 | v145.48,16.23 134.46,16.23 133.63,17.06 123.09,17.06 121.9,18.25 v121.9,19.24
  L3-GND/AC_L 0.203: ADC12.TP 121.9,17.97 v121.9,19.24
AC_L  (via drill 0.4)
  L1-GND/SIG 0.61: v31.5,53.5 v33,53.5 | v33,53.5 v34.5,53.5 | v33,53.5 33,51.63 R62.1 | v52.5,53.5 v54,53.5 | v54,53.5 v55.5,53.5 | v54,53.5 54,51.63 R106.1
  L3-GND/AC_L 2.54: AC/DC1.AC_L 74.36,24.66 75.45,25.75 75.45,52.35 75.3,52.5 65.5,52.5 | AC/DC2.AC/L 65.74,52.26 65.5,52.5 | 65.5,52.5 13.25,52.5 AC_L.1
  other vias: 20,78 22,78 24,78 26,78 28,78 30,78 30,74 28,74 26,74 24,74 22,74 20,74 29,76 27,76 25,76 23,76 21,76 25,80 24,82 26,82 43.5,78 45.5,78 47.5,78 49.5,78 51.5,78 53.5,78 53.5,74 51.5,74 49.5,74 47.5,74 45.5,74 43.5,74 52.5,76 50.5,76 48.5,76 46.5,76 44.5,76 48.5,80 47.5,82 49.5,82 67,78 69,78 71,78 73,78 75,78 77,78 77,74 75,74 73,74 71,74 69,74 67,74 76,76 74,76 72,76 70,76 68,76 72,80 71,82 73,82 91,77.5 93,77.5 95,77.5 97,77.5 99,77.5 101,77.5 101,73.5 99,73.5 97,73.5 95,73.5 93,73.5 91,73.5 100,75.5 98,75.5 96,75.5 94,75.5 92,75.5 96,79.5 95,81.5 97,81.5 115,78 117,78 119,78 121,78 123,78 125,78 125,74 123,74 121,74 119,74 117,74 115,74 124,76 122,76 120,76 118,76 116,76 120,80 119,82 121,82 139.5,78 141.5,78 143.5,78 145.5,78 147.5,78 149.5,78 149.5,74 147.5,74 145.5,74 143.5,74 141.5,74 139.5,74 148.5,76 146.5,76 144.5,76 142.5,76 140.5,76 144.5,80 143.5,82 145.5,82 164,78 166,78 168,78 170,78 172,78 174,78 174,74 172,74 170,74 168,74 166,74 164,74 173,76 171,76 169,76 167,76 165,76 169,80 168,82 170,82 189,78 191,78 193,78 195,78 197,78 199,78 199,74 197,74 195,74 193,74 191,74 189,74 198,76 196,76 194,76 192,76 190,76 194,80 193,82 195,82 20,56 20,54 20,52 24,52 24,54 24,56 28,56 28,54 28,52 22,55 22,53 26,55 26,53 30,55 30,53 12,60 14,60 16,60 13,62 15,62 12,64 14,64 16,64 17,62
  pour L3-GND/AC_L (isolate 0.813, no thermals): 11,50 11,82.5 200.5,82.5 200.5,50 195,50 195,53 158,53 158,50
  pour L5-SIG_LS/AC_L (isolate 0.813, no thermals): 11,50 11,82.5 200.5,82.5 200.5,50 195,50 195,53 158,53 158,50
ADC_TEMP  (via drill 0.2)
  L1-GND/SIG 0.148: IC23.3 165.08,5.16 v165.08,6.07 | IC15.39 161.36,13.69 v161.36,13.57
  L2-SIG-HS/AGND 0.148: v165.08,6.07 165.08,7.2 164.56,7.72 164.56,9.83 162.3,12.09 162.3,12.63 v161.36,13.57
  L3-GND/AC_L 0.152: ADC_TEMP.TP v165.08,6.07
ADC_V_USB  (via drill 0.2)
  L1-GND/SIG 0.149: IC15.38 159.38,15.1 v159.34,15.1
  L1-GND/SIG 0.2: 169.74,14.42 169.13,14.42 v168.99,14.28
  L1-GND/SIG 0.254: R126.2 169.74,14.42 169.74,14.06 R127.1
  L2-SIG-HS/AGND 0.15: v162.22,14.11 164.24,12.09 v165.49,12.09